# EAGLE design tarjeta (EAGLE 8.4.1)
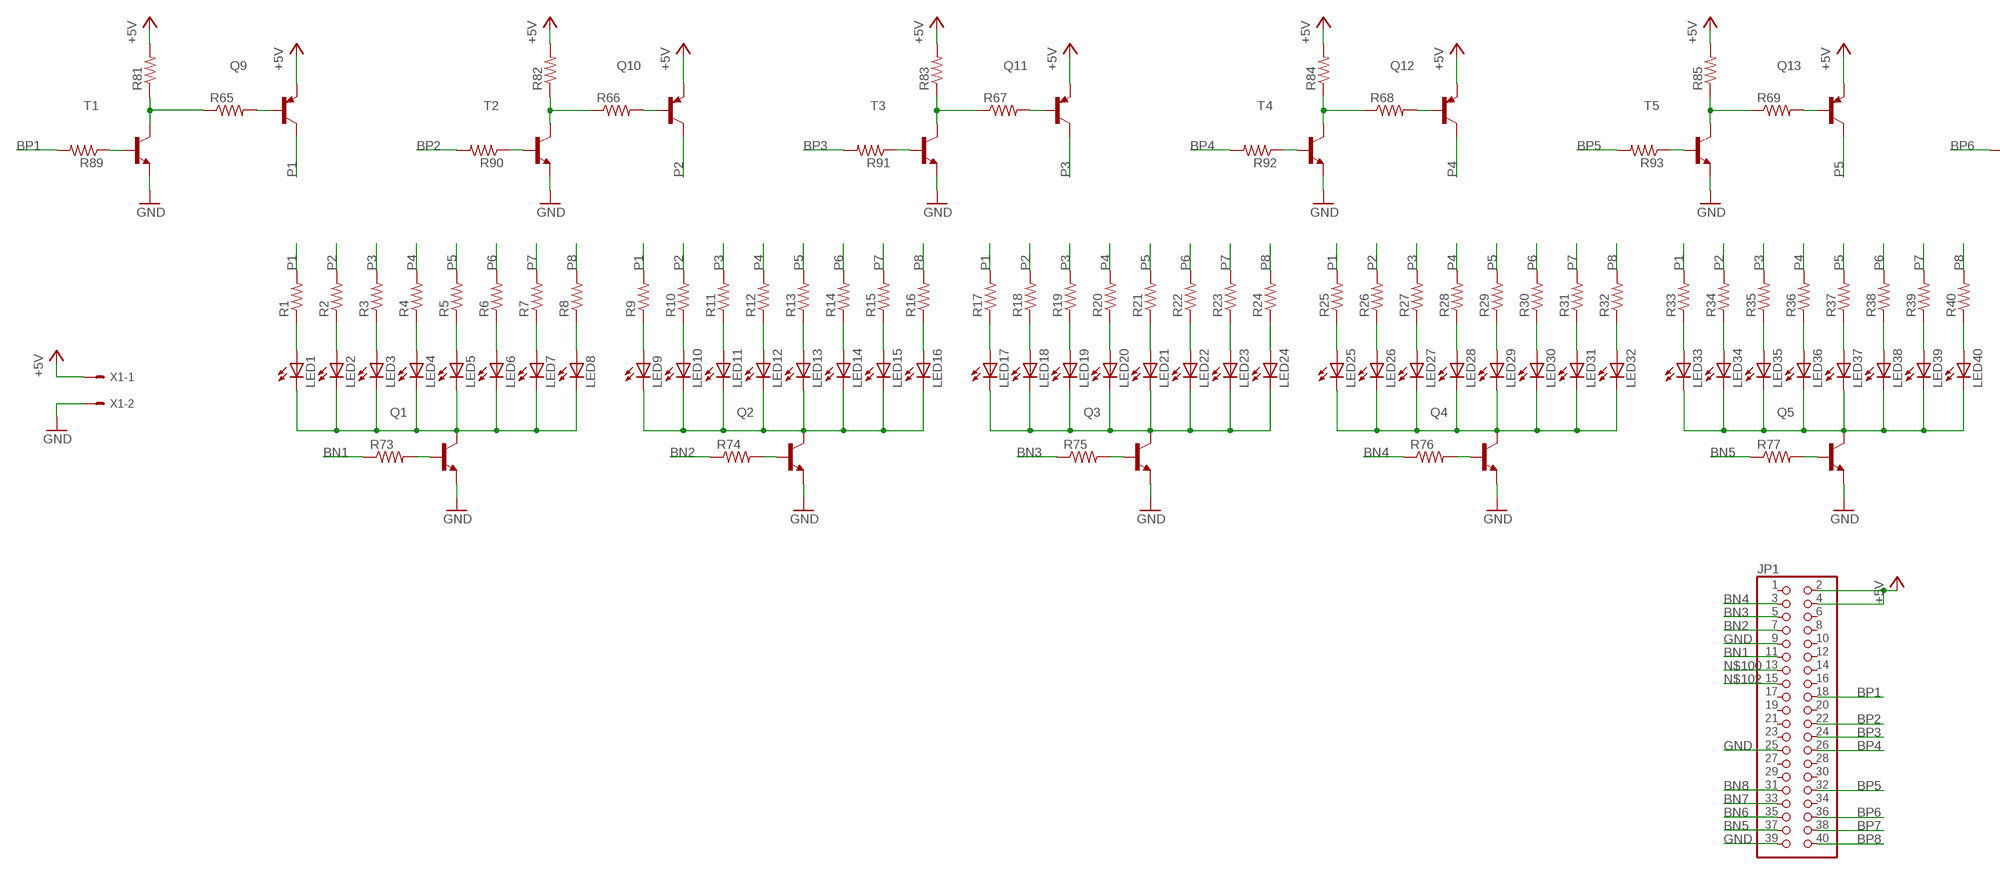
[diagram p0: schematic, sheet 1, part 1 of 2]
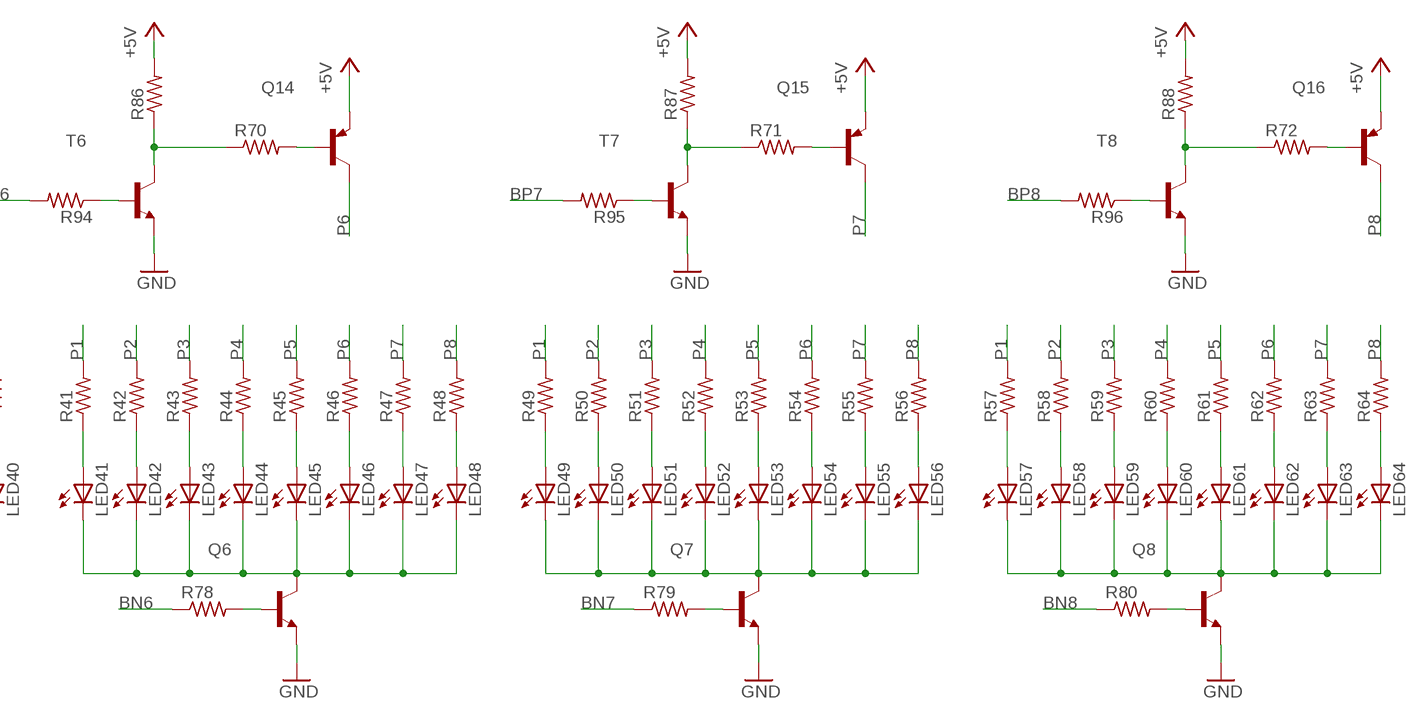
[diagram p1: schematic, sheet 1, part 2 of 2]

## Parts
JP1  PINHD-2X20  [2X20]
LED1  LED5MM  [LED5MM]
LED2  LED5MM  [LED5MM]
LED3  LED5MM  [LED5MM]
LED4  LED5MM  [LED5MM]
LED5  LED5MM  [LED5MM]
LED6  LED5MM  [LED5MM]
LED7  LED5MM  [LED5MM]
LED8  LED5MM  [LED5MM]
LED9  LED5MM  [LED5MM]
LED10  LED5MM  [LED5MM]
LED11  LED5MM  [LED5MM]
LED12  LED5MM  [LED5MM]
LED13  LED5MM  [LED5MM]
LED14  LED5MM  [LED5MM]
LED15  LED5MM  [LED5MM]
LED16  LED5MM  [LED5MM]
LED17  LED5MM  [LED5MM]
LED18  LED5MM  [LED5MM]
LED19  LED5MM  [LED5MM]
LED20  LED5MM  [LED5MM]
LED21  LED5MM  [LED5MM]
LED22  LED5MM  [LED5MM]
LED23  LED5MM  [LED5MM]
LED24  LED5MM  [LED5MM]
LED25  LED5MM  [LED5MM]
LED26  LED5MM  [LED5MM]
LED27  LED5MM  [LED5MM]
LED28  LED5MM  [LED5MM]
LED29  LED5MM  [LED5MM]
LED30  LED5MM  [LED5MM]
LED31  LED5MM  [LED5MM]
LED32  LED5MM  [LED5MM]
LED33  LED5MM  [LED5MM]
LED34  LED5MM  [LED5MM]
LED35  LED5MM  [LED5MM]
LED36  LED5MM  [LED5MM]
LED37  LED5MM  [LED5MM]
LED38  LED5MM  [LED5MM]
LED39  LED5MM  [LED5MM]
LED40  LED5MM  [LED5MM]
LED41  LED5MM  [LED5MM]
LED42  LED5MM  [LED5MM]
LED43  LED5MM  [LED5MM]
LED44  LED5MM  [LED5MM]
LED45  LED5MM  [LED5MM]
LED46  LED5MM  [LED5MM]
LED47  LED5MM  [LED5MM]
LED48  LED5MM  [LED5MM]
LED49  LED5MM  [LED5MM]
LED50  LED5MM  [LED5MM]
LED51  LED5MM  [LED5MM]
LED52  LED5MM  [LED5MM]
LED53  LED5MM  [LED5MM]
LED54  LED5MM  [LED5MM]
LED55  LED5MM  [LED5MM]
LED56  LED5MM  [LED5MM]
LED57  LED5MM  [LED5MM]
LED58  LED5MM  [LED5MM]
LED59  LED5MM  [LED5MM]
LED60  LED5MM  [LED5MM]
LED61  LED5MM  [LED5MM]
LED62  LED5MM  [LED5MM]
LED63  LED5MM  [LED5MM]
LED64  LED5MM  [LED5MM]
Q1  2N2222TO92-CBE  [TO92-CBE]
Q2  2N2222TO92-CBE  [TO92-CBE]
Q3  2N2222TO92-CBE  [TO92-CBE]
Q4  2N2222TO92-CBE  [TO92-CBE]
Q5  2N2222TO92-CBE  [TO92-CBE]
Q6  2N2222TO92-CBE  [TO92-CBE]
Q7  2N2222TO92-CBE  [TO92-CBE]
Q8  2N2222TO92-CBE  [TO92-CBE]
Q9  2N2907TO92-CBE  [TO92-CBE]
Q10  2N2907TO92-CBE  [TO92-CBE]
Q11  2N2907TO92-CBE  [TO92-CBE]
Q12  2N2907TO92-CBE  [TO92-CBE]
Q13  2N2907TO92-CBE  [TO92-CBE]
Q14  2N2907TO92-CBE  [TO92-CBE]
Q15  2N2907TO92-CBE  [TO92-CBE]
Q16  2N2907TO92-CBE  [TO92-CBE]
R1  R-US_0204/7  [0204/7]
R2  R-US_0204/7  [0204/7]
R3  R-US_0204/7  [0204/7]
R4  R-US_0204/7  [0204/7]
R5  R-US_0204/7  [0204/7]
R6  R-US_0204/7  [0204/7]
R7  R-US_0204/7  [0204/7]
R8  R-US_0204/7  [0204/7]
R9  R-US_0204/7  [0204/7]
R10  R-US_0204/7  [0204/7]
R11  R-US_0204/7  [0204/7]
R12  R-US_0204/7  [0204/7]
R13  R-US_0204/7  [0204/7]
R14  R-US_0204/7  [0204/7]
R15  R-US_0204/7  [0204/7]
R16  R-US_0204/7  [0204/7]
R17  R-US_0204/7  [0204/7]
R18  R-US_0204/7  [0204/7]
R19  R-US_0204/7  [0204/7]
R20  R-US_0204/7  [0204/7]
R21  R-US_0204/7  [0204/7]
R22  R-US_0204/7  [0204/7]
R23  R-US_0204/7  [0204/7]
R24  R-US_0204/7  [0204/7]
R25  R-US_0204/7  [0204/7]
R26  R-US_0204/7  [0204/7]
R27  R-US_0204/7  [0204/7]
R28  R-US_0204/7  [0204/7]
R29  R-US_0204/7  [0204/7]
R30  R-US_0204/7  [0204/7]
R31  R-US_0204/7  [0204/7]
R32  R-US_0204/7  [0204/7]
R33  R-US_0204/7  [0204/7]
R34  R-US_0204/7  [0204/7]
R35  R-US_0204/7  [0204/7]
R36  R-US_0204/7  [0204/7]
R37  R-US_0204/7  [0204/7]
R38  R-US_0204/7  [0204/7]
R39  R-US_0204/7  [0204/7]
R40  R-US_0204/7  [0204/7]
R41  R-US_0204/7  [0204/7]
R42  R-US_0204/7  [0204/7]
R43  R-US_0204/7  [0204/7]
R44  R-US_0204/7  [0204/7]
R45  R-US_0204/7  [0204/7]
R46  R-US_0204/7  [0204/7]
R47  R-US_0204/7  [0204/7]
R48  R-US_0204/7  [0204/7]
R49  R-US_0204/7  [0204/7]
R50  R-US_0204/7  [0204/7]
R51  R-US_0204/7  [0204/7]
R52  R-US_0204/7  [0204/7]
R53  R-US_0204/7  [0204/7]
R54  R-US_0204/7  [0204/7]
R55  R-US_0204/7  [0204/7]
R56  R-US_0204/7  [0204/7]
R57  R-US_0204/7  [0204/7]
R58  R-US_0204/7  [0204/7]
R59  R-US_0204/7  [0204/7]
R60  R-US_0204/7  [0204/7]
R61  R-US_0204/7  [0204/7]
R62  R-US_0204/7  [0204/7]
R63  R-US_0204/7  [0204/7]
R64  R-US_0204/7  [0204/7]
R65  R-US_0204/7  [0204/7]
R66  R-US_0204/7  [0204/7]
R67  R-US_0204/7  [0204/7]
R68  R-US_0204/7  [0204/7]
R69  R-US_0204/7  [0204/7]
R70  R-US_0204/7  [0204/7]
R71  R-US_0204/7  [0204/7]
R72  R-US_0204/7  [0204/7]
R73  R-US_0204/7  [0204/7]
R74  R-US_0204/7  [0204/7]
R75  R-US_0204/7  [0204/7]
R76  R-US_0204/7  [0204/7]
R77  R-US_0204/7  [0204/7]
R78  R-US_0204/7  [0204/7]
R79  R-US_0204/7  [0204/7]
R80  R-US_0204/7  [0204/7]
R81  R-US_0204/7  [0204/7]
R82  R-US_0204/7  [0204/7]
R83  R-US_0204/7  [0204/7]
R84  R-US_0204/7  [0204/7]
R85  R-US_0204/7  [0204/7]
R86  R-US_0204/7  [0204/7]
R87  R-US_0204/7  [0204/7]
R88  R-US_0204/7  [0204/7]
R89  R-US_0204/7  [0204/7]
R90  R-US_0204/7  [0204/7]
R91  R-US_0204/7  [0204/7]
R92  R-US_0204/7  [0204/7]
R93  R-US_0204/7  [0204/7]
R94  R-US_0204/7  [0204/7]
R95  R-US_0204/7  [0204/7]
R96  R-US_0204/7  [0204/7]
T1  2N3904TO92-CBE  [TO92-CBE]
T2  2N3904TO92-CBE  [TO92-CBE]
T3  2N3904TO92-CBE  [TO92-CBE]
T4  2N3904TO92-CBE  [TO92-CBE]
T5  2N3904TO92-CBE  [TO92-CBE]
T6  2N3904TO92-CBE  [TO92-CBE]
T7  2N3904TO92-CBE  [TO92-CBE]
T8  2N3904TO92-CBE  [TO92-CBE]
X1  KK-156-2  [KK-156-2]

## Nets
+5V: JP1.2 JP1.4 Q9.E Q10.E Q11.E Q12.E Q13.E Q14.E Q15.E Q16.E R81.2 R82.2 R83.2 R84.2 R85.2 R86.2 R87.2 R88.2 X1.1
BN1: JP1.11 R73.1
BN2: JP1.7 R74.1
BN3: JP1.5 R75.1
BN4: JP1.3 R76.1
BN5: JP1.37 R77.1
BN6: JP1.35 R78.1
BN7: JP1.33 R79.1
BN8: JP1.31 R80.1
BP1: JP1.18 R89.2
BP2: JP1.22 R90.2
BP3: JP1.24 R91.2
BP4: JP1.26 R92.2
BP5: JP1.32 R93.2
BP6: JP1.36 R94.2
BP7: JP1.38 R95.2
BP8: JP1.40 R96.2
GND: JP1.9 JP1.25 JP1.39 Q1.E Q2.E Q3.E Q4.E Q5.E Q6.E Q7.E Q8.E T1.E T2.E T3.E T4.E T5.E T6.E T7.E T8.E X1.2
N$1: LED1.K(C) LED2.K(C) LED3.K(C) LED4.K(C) LED5.K(C) LED6.K(C) LED7.K(C) LED8.K(C) Q1.C
N$2: LED1.A R1.1
N$3: LED2.A R2.1
N$4: LED3.A R3.1
N$5: LED4.A R4.1
N$6: LED5.A R5.1
N$7: LED6.A R6.1
N$8: LED7.A R7.1
N$9: LED8.A R8.1
N$10: LED9.K(C) LED10.K(C) LED11.K(C) LED12.K(C) LED13.K(C) LED14.K(C) LED15.K(C) LED16.K(C) Q2.C
N$11: LED9.A R9.1
N$12: LED10.A R10.1
N$13: LED11.A R11.1
N$14: LED12.A R12.1
N$15: LED13.A R13.1
N$16: LED14.A R14.1
N$17: LED15.A R15.1
N$18: LED16.A R16.1
N$19: LED17.K(C) LED18.K(C) LED19.K(C) LED20.K(C) LED21.K(C) LED22.K(C) LED23.K(C) LED24.K(C) Q3.C
N$20: LED17.A R17.1
N$21: LED18.A R18.1
N$22: LED19.A R19.1
N$23: LED20.A R20.1
N$24: LED21.A R21.1
N$25: LED22.A R22.1
N$26: LED23.A R23.1
N$27: LED24.A R24.1
N$28: LED25.K(C) LED26.K(C) LED27.K(C) LED28.K(C) LED29.K(C) LED30.K(C) LED31.K(C) LED32.K(C) Q4.C
N$29: LED25.A R25.1
N$30: LED26.A R26.1
N$31: LED27.A R27.1
N$32: LED28.A R28.1
N$33: LED29.A R29.1
N$34: LED30.A R30.1
N$35: LED31.A R31.1
N$36: LED32.A R32.1
N$37: LED33.K(C) LED34.K(C) LED35.K(C) LED36.K(C) LED37.K(C) LED38.K(C) LED39.K(C) LED40.K(C) Q5.C
N$38: LED33.A R33.1
N$39: LED34.A R34.1
N$40: LED35.A R35.1
N$41: LED36.A R36.1
N$42: LED37.A R37.1
N$43: LED38.A R38.1
N$44: LED39.A R39.1
N$45: LED40.A R40.1
N$46: LED41.K(C) LED42.K(C) LED43.K(C) LED44.K(C) LED45.K(C) LED46.K(C) LED47.K(C) LED48.K(C) Q6.C
N$47: LED41.A R41.1
N$48: LED42.A R42.1
N$49: LED43.A R43.1
N$50: LED44.A R44.1
N$51: LED45.A R45.1
N$52: LED46.A R46.1
N$53: LED47.A R47.1
N$54: LED48.A R48.1
N$55: LED49.K(C) LED50.K(C) LED51.K(C) LED52.K(C) LED53.K(C) LED54.K(C) LED55.K(C) LED56.K(C) Q7.C
N$56: LED49.A R49.1
N$57: LED50.A R50.1
N$58: LED51.A R51.1
N$59: LED52.A R52.1
N$60: LED53.A R53.1
N$61: LED54.A R54.1
N$62: LED55.A R55.1
N$63: LED56.A R56.1
N$64: LED57.K(C) LED58.K(C) LED59.K(C) LED60.K(C) LED61.K(C) LED62.K(C) LED63.K(C) LED64.K(C) Q8.C
N$65: LED57.A R57.1
N$66: LED58.A R58.1
N$67: LED59.A R59.1
N$68: LED60.A R60.1
N$69: LED61.A R61.1
N$70: LED62.A R62.1
N$71: LED63.A R63.1
N$72: LED64.A R64.1
N$73: Q9.B R65.2
N$74: R65.1 R81.1 T1.C
N$75: R66.1 R82.1 T2.C
N$76: Q10.B R66.2
N$77: R67.1 R83.1 T3.C
N$78: Q11.B R67.2
N$79: R68.1 R84.1 T4.C
N$80: Q12.B R68.2
N$81: R69.1 R85.1 T5.C
N$82: Q13.B R69.2
N$83: R70.1 R86.1 T6.C
N$84: Q14.B R70.2
N$85: R71.1 R87.1 T7.C
N$86: Q15.B R71.2
N$87: R72.1 R88.1 T8.C
N$88: Q16.B R72.2
N$89: Q8.B R80.2
N$90: Q7.B R79.2
N$91: Q6.B R78.2
N$92: Q5.B R77.2
N$93: Q4.B R76.2
N$94: Q3.B R75.2
N$95: Q2.B R74.2
N$96: Q1.B R73.2
N$97: R96.1 T8.B
N$99: R95.1 T7.B
N$100: JP1.13
N$101: R94.1 T6.B
N$102: JP1.15
N$103: R93.1 T5.B
N$105: R92.1 T4.B
N$107: R91.1 T3.B
N$109: R89.1 T1.B
N$110: R90.1 T2.B
P1: Q9.C R1.2 R9.2 R17.2 R25.2 R33.2 R41.2 R49.2 R57.2
P2: Q10.C R2.2 R10.2 R18.2 R26.2 R34.2 R42.2 R50.2 R58.2
P3: Q11.C R3.2 R11.2 R19.2 R27.2 R35.2 R43.2 R51.2 R59.2
P4: Q12.C R4.2 R12.2 R20.2 R28.2 R36.2 R44.2 R52.2 R60.2
P5: Q13.C R5.2 R13.2 R21.2 R29.2 R37.2 R45.2 R53.2 R61.2
P6: Q14.C R6.2 R14.2 R22.2 R30.2 R38.2 R46.2 R54.2 R62.2
P7: Q15.C R7.2 R15.2 R23.2 R31.2 R39.2 R47.2 R55.2 R63.2
P8: Q16.C R8.2 R16.2 R24.2 R32.2 R40.2 R48.2 R56.2 R64.2
Unconnected: JP1.1 JP1.6 JP1.8 JP1.10 JP1.12 JP1.14 JP1.16 JP1.17 JP1.19 JP1.20 JP1.21 JP1.23 JP1.27 JP1.28 JP1.29 JP1.30 JP1.34

## Library data of the parts
JP1 = pinhead:PINHD-2X20: PIN HEADER
LED1-LED32 LED34-LED64 = introduccion:LED: LED OSRAM: - CHIPLED LG R971, LG N971, LY N971, LG Q971, LY Q971, LO R971, LY R971 LH N974, LH R974 LS Q976, LO Q976, LY Q976 LO Q996 - Hyper CHIPLED LW Q18S LB Q993, LB Q99A, LB R99A - SideLED LS A670, LO A670, LY A670, LG A670, LP A670 LB A673, LV A673, LT A673, LW A673 LH A674 LY A675 LS A676, LA A676, LO A676, LY A676, LW A676 LS A679, LY A679, LG A679 - Hyper Micro SIDELED® LS Y876, LA Y876, LO Y876, LY Y876 LT Y87S - SmartLED LW L88C, LW L88S LB L89C, LB L89S, LG L890 LS L89K, LO L89K, LY L89K LS L896, LA L896, LO L896, LY L896 - TOPLED LS T670, LO T670, LY T670, LG T670, LP T670 LSG T670, LSP T670, LSY T670, LOP T670, LYG T670 LG T671, LOG T671, LSG T671 LB T673, LV T673, LT T673, LW T673 LH T674 LS T676, LA T676, LO T676, LY T676, LB T676, LH T676, LSB T676, LW T676 LB T67C, LV T67C, LT T67C, LS T67K, LO T67K, LY T67K, LW E67C LS E67B, LA E67B, LO E67B, LY E67B, LB E67C, LV E67C, LT E67C LW T67C LS T679, LY T679, LG T679 LS T770, LO T770, LY T770, LG T770, LP T770 LB T773, LV T773, LT T773, LW T773 LH T774 LS E675, LA E675, LY E675, LS T675 LS T776, LA T776, LO T776, LY T776, LB T776 LHGB T686 LT T68C, LB T68C - Hyper Mini TOPLED® LB M676 - Mini TOPLED Santana® LG M470 LS M47K, LO M47K, LY M47K Source: http://www.osram.convergy.de LUXEON: - LUMILED® LXK2-PW12-R00, LXK2-PW12-S00, LXK2-PW14-U00, LXK2-PW14-V00 LXK2-PM12-R00, LXK2-PM12-S00, LXK2-PM14-U00 LXK2-PE12-Q00, LXK2-PE12-R00, LXK2-PE12-S00, LXK2-PE14-T00, LXK2-PE14-U00 LXK2-PB12-K00, LXK2-PB12-L00, LXK2-PB12-M00, LXK2-PB14-N00, LXK2-PB14-P00, LXK2-PB14-Q00 LXK2-PR12-L00, LXK2-PR12-M00, LXK2-PR14-Q00, LXK2-PR14-R00 LXK2-PD12-Q00, LXK2-PD12-R00, LXK2-PD12-S00 LXK2-PH12-R00, LXK2-PH12-S00 LXK2-PL12-P00, LXK2-PL12-Q00, LXK2-PL12-R00 Source: www.luxeon.com KINGBRIGHT: KA-3528ASYC Source: www.kingbright.com
LED33 = led:LED: LED OSRAM: - CHIPLED LG R971, LG N971, LY N971, LG Q971, LY Q971, LO R971, LY R971 LH N974, LH R974 LS Q976, LO Q976, LY Q976 LO Q996 - Hyper CHIPLED LW Q18S LB Q993, LB Q99A, LB R99A - SideLED LS A670, LO A670, LY A670, LG A670, LP A670 LB A673, LV A673, LT A673, LW A673 LH A674 LY A675 LS A676, LA A676, LO A676, LY A676, LW A676 LS A679, LY A679, LG A679 - Hyper Micro SIDELED® LS Y876, LA Y876, LO Y876, LY Y876 LT Y87S - SmartLED LW L88C, LW L88S LB L89C, LB L89S, LG L890 LS L89K, LO L89K, LY L89K LS L896, LA L896, LO L896, LY L896 - TOPLED LS T670, LO T670, LY T670, LG T670, LP T670 LSG T670, LSP T670, LSY T670, LOP T670, LYG T670 LG T671, LOG T671, LSG T671 LB T673, LV T673, LT T673, LW T673 LH T674 LS T676, LA T676, LO T676, LY T676, LB T676, LH T676, LSB T676, LW T676 LB T67C, LV T67C, LT T67C, LS T67K, LO T67K, LY T67K, LW E67C LS E67B, LA E67B, LO E67B, LY E67B, LB E67C, LV E67C, LT E67C LW T67C LS T679, LY T679, LG T679 LS T770, LO T770, LY T770, LG T770, LP T770 LB T773, LV T773, LT T773, LW T773 LH T774 LS E675, LA E675, LY E675, LS T675 LS T776, LA T776, LO T776, LY T776, LB T776 LHGB T686 LT T68C, LB T68C - Hyper Mini TOPLED® LB M676 - Mini TOPLED Santana® LG M470 LS M47K, LO M47K, LY M47K Source: http://www.osram.convergy.de LUXEON: - LUMILED® LXK2-PW12-R00, LXK2-PW12-S00, LXK2-PW14-U00, LXK2-PW14-V00 LXK2-PM12-R00, LXK2-PM12-S00, LXK2-PM14-U00 LXK2-PE12-Q00, LXK2-PE12-R00, LXK2-PE12-S00, LXK2-PE14-T00, LXK2-PE14-U00 LXK2-PB12-K00, LXK2-PB12-L00, LXK2-PB12-M00, LXK2-PB14-N00, LXK2-PB14-P00, LXK2-PB14-Q00 LXK2-PR12-L00, LXK2-PR12-M00, LXK2-PR14-Q00, LXK2-PR14-R00 LXK2-PD12-Q00, LXK2-PD12-R00, LXK2-PD12-S00 LXK2-PH12-R00, LXK2-PH12-S00 LXK2-PL12-P00, LXK2-PL12-Q00, LXK2-PL12-R00 Source: www.luxeon.com KINGBRIGHT: KA-3528ASYC Source: www.kingbright.com
Q1-Q8 = introduccion:2N2222*: NPN Transistor
Q9-Q16 = introduccion:2N2907*: PNP Transistor
R1-R96 = rcl:R-US_: RESISTOR, American symbol
T1-T8 = introduccion:2N3904: NPN TRANSISTOR
X1 = con-molex:KK-156-2: KK 156 HEADER Source: http://www.molex.com/pdm_docs/sd/026604100_sd.pdf; OC_FARNELL: unknown; OC_NEWARK: unknown

## Board
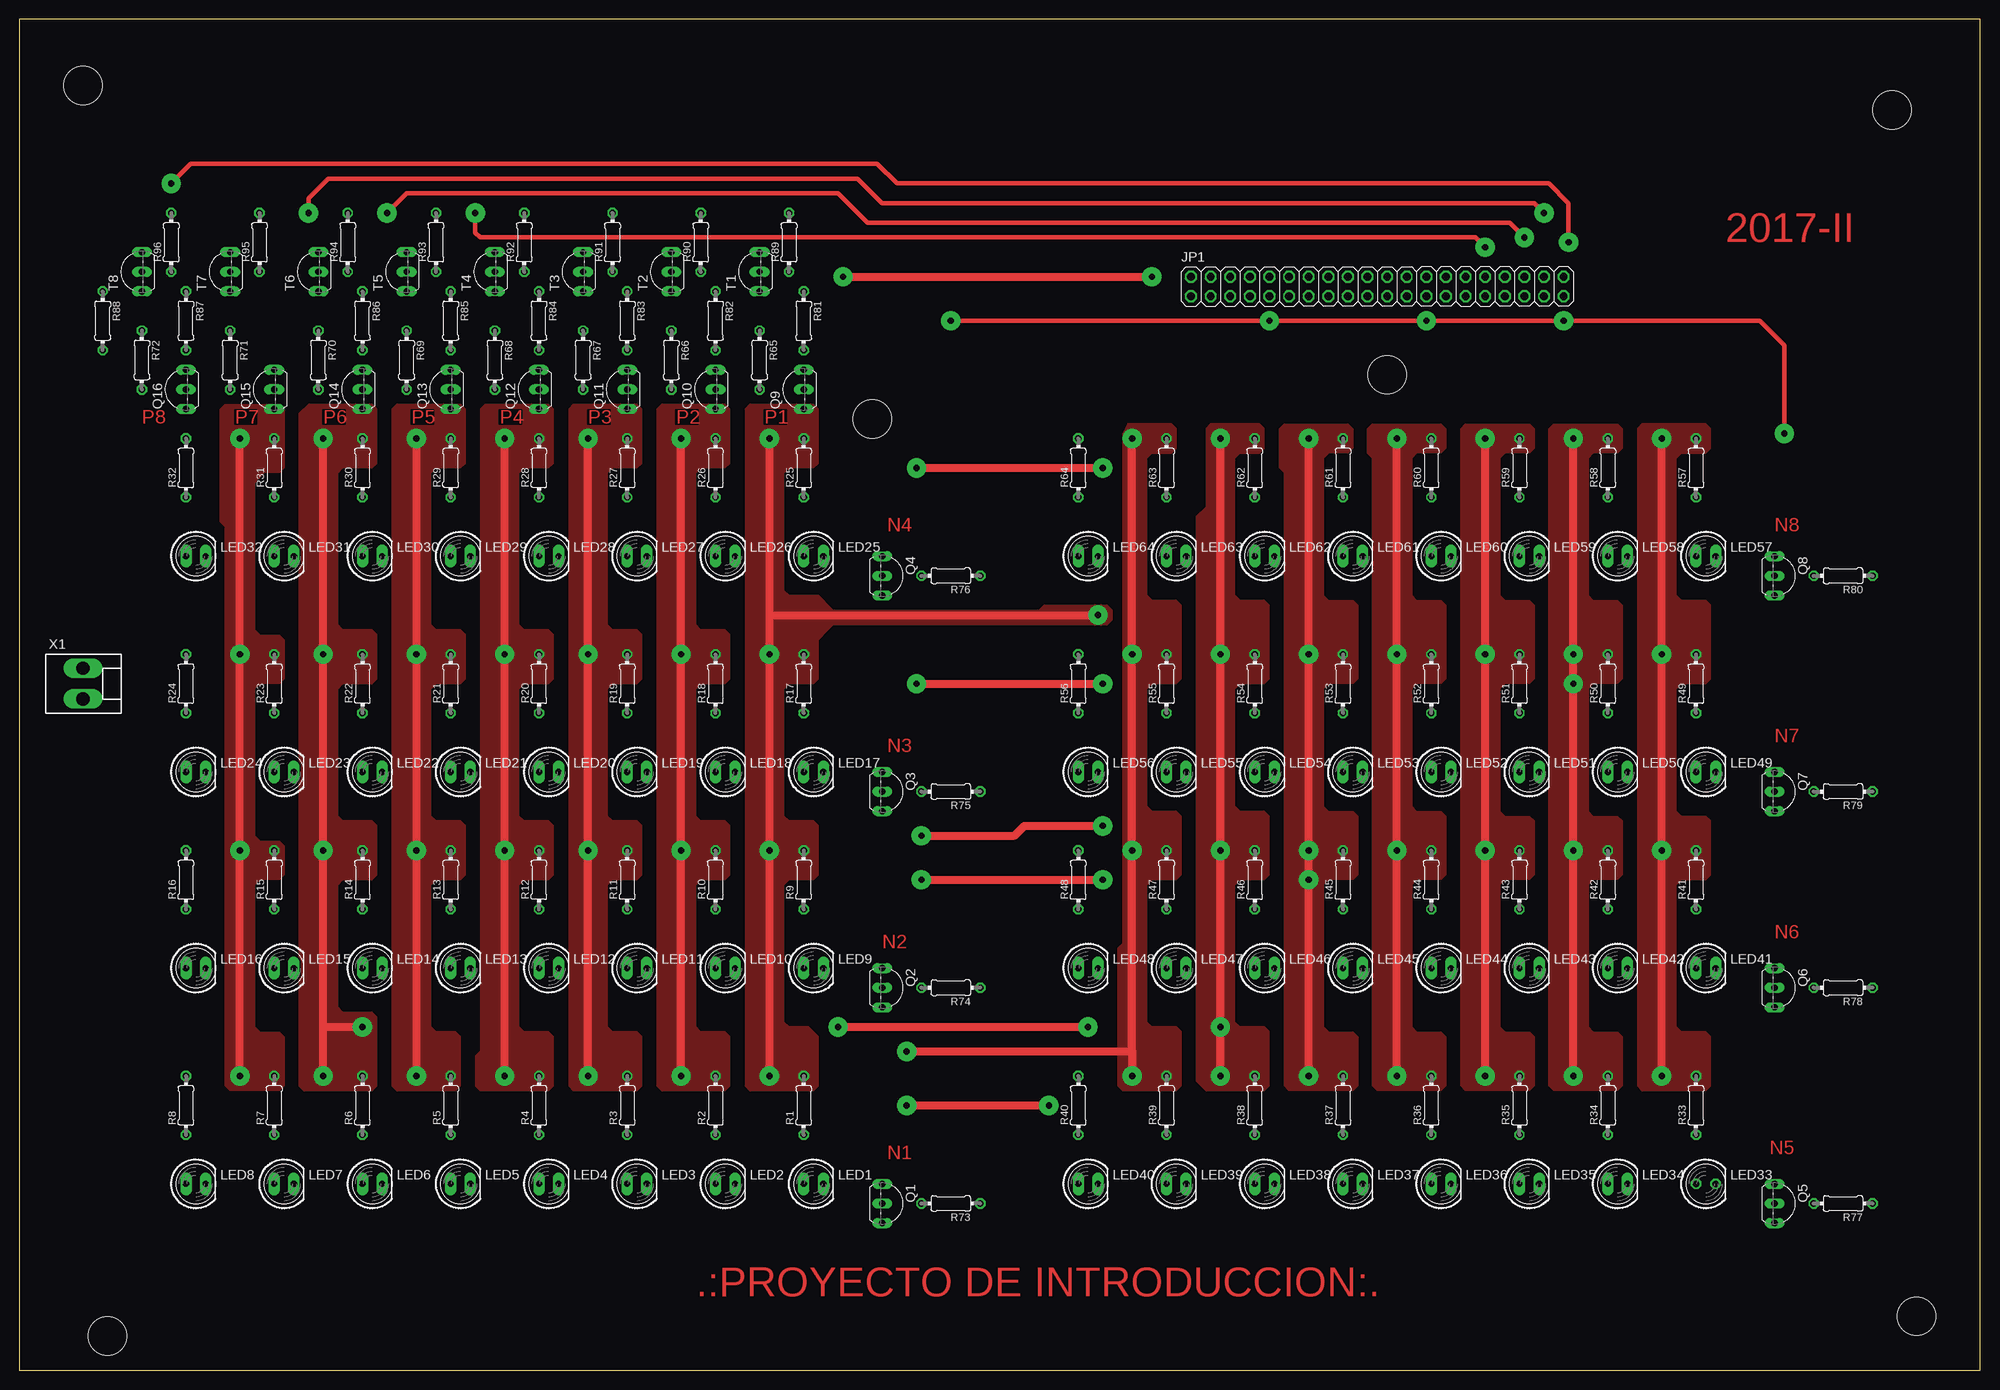
[diagram p2: board, top side]
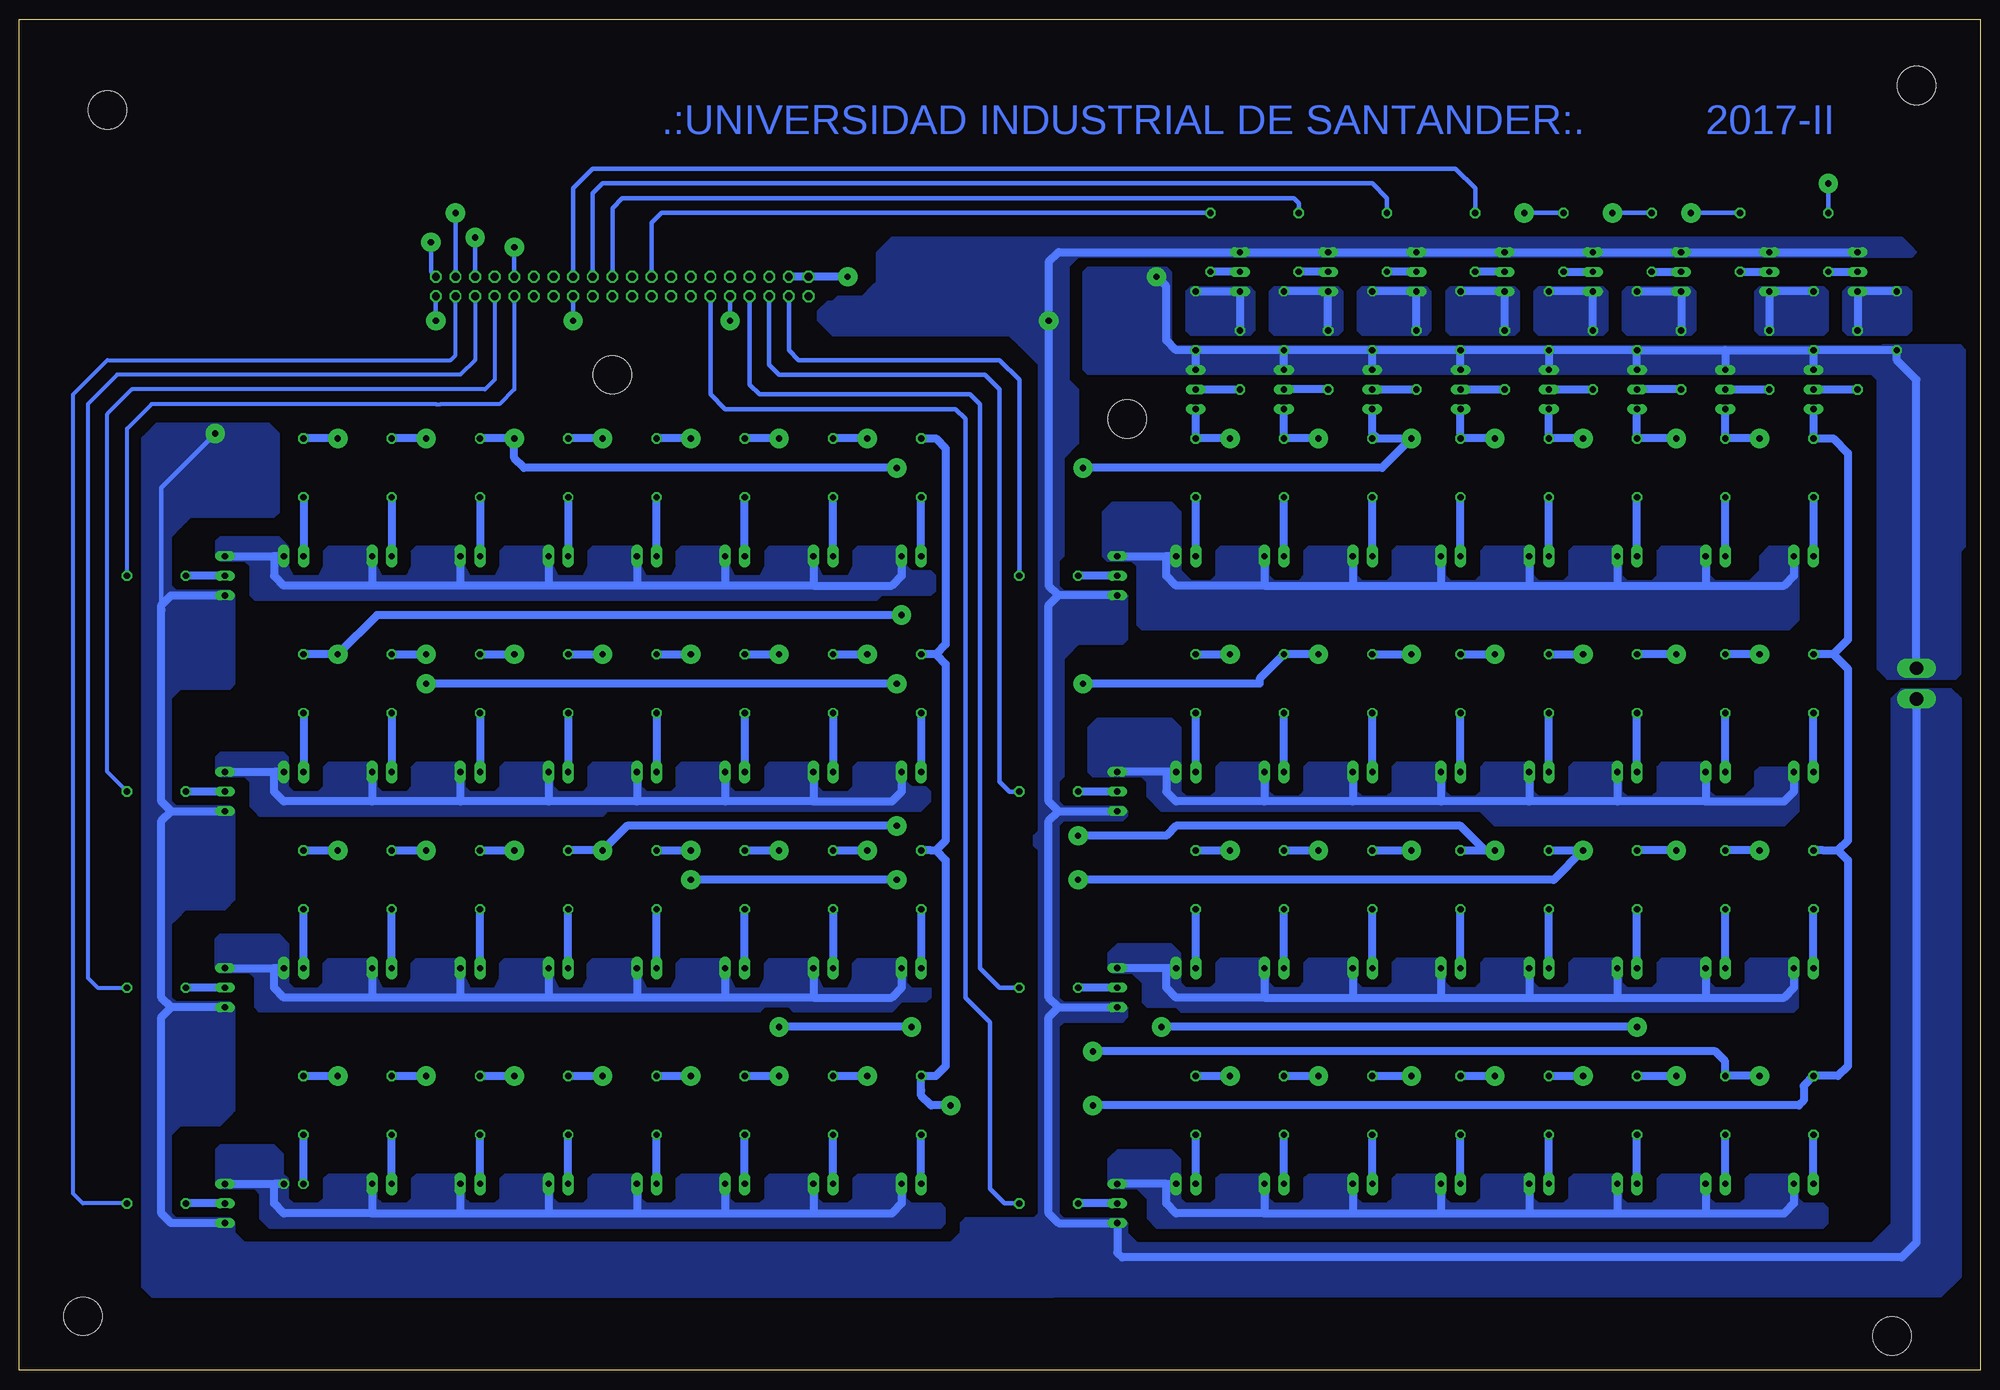
[diagram p3: board, bottom side, seen from below]

Size 253.98 x 174.93 mm. Coordinates in mm from the lower left corner, seen from the top.
Outline: 0,0 253.98,0 253.98,174.93 0,174.93 0,0
Copper layers (1*16): Top 0.035mm / dielectric 1.5mm / Bottom 0.035mm
Design rules "default": minimum track width 6mil, minimum drill 0.35mm, track to track 6mil, track to pad 6mil, pad to pad 6mil, via to via 6mil, smd to smd 6mil, copper to edge 40mil, drill to drill 6mil, minimum pad ring 10mil, minimum via ring 8mil, stop-mask expansion 4mil, vias tented up to drill 0mil, thermal gap 10mil
Holes 5 mm at 8.25,166.37 242.57,163.19 11.43,4.45 245.74,6.99 110.49,123.19 177.16,128.91

### Footprints (pad centres in the part's own frame; a part is rotated, then mirrored left to right if it is on the bottom)
2X20 = drill 1.016 octagon: 1 -24.13,-1.27; 2 -24.13,1.27; 3 -21.59,-1.27; 4 -21.59,1.27; 5 -19.05,-1.27; 6 -19.05,1.27; 7 -16.51,-1.27; 8 -16.51,1.27; 9 -13.97,-1.27; 10 -13.97,1.27; 11 -11.43,-1.27; 12 -11.43,1.27; 13 -8.89,-1.27; 14 -8.89,1.27; 15 -6.35,-1.27; 16 -6.35,1.27; 17 -3.81,-1.27; 18 -3.81,1.27; 19 -1.27,-1.27; 20 -1.27,1.27; 21 1.27,-1.27; 22 1.27,1.27; 23 3.81,-1.27; 24 3.81,1.27; 25 6.35,-1.27; 26 6.35,1.27; 27 8.89,-1.27; 28 8.89,1.27; 29 11.43,-1.27; 30 11.43,1.27; 31 13.97,-1.27; 32 13.97,1.27; 33 16.51,-1.27; 34 16.51,1.27; 35 19.05,-1.27; 36 19.05,1.27; 37 21.59,-1.27; 38 21.59,1.27; 39 24.13,-1.27; 40 24.13,1.27
LED5MM = drill 0.8 pad 1.5 long: A -1.27,0; K 1.27,0
LED5MM' = drill 0.813 octagon: A -1.27,0; K 1.27,0
TO92-CBE = drill 0.813 long: B 0,0; C -2.54,0; E 2.54,0
0204/7 = drill 0.813 octagon: 1 -3.81,0; 2 3.81,0
KK-156-2 = drill 1.7 pad 2.184 long: 1 -1.98,0; 2 1.98,0

### Placement (x,y rotation side)
JP1  175.9,140.34 0 top
LED1  102.87,24.13 0 top
LED2  91.44,24.13 0 top
LED3  80.01,24.13 0 top
LED4  68.58,24.13 0 top
LED5  57.15,24.13 0 top
LED6  45.72,24.13 0 top
LED7  34.29,24.13 0 top
LED8  22.86,24.13 0 top
LED9  102.87,52.07 0 top
LED10  91.44,52.07 0 top
LED11  80.01,52.07 0 top
LED12  68.58,52.07 0 top
LED13  57.15,52.07 0 top
LED14  45.72,52.07 0 top
LED15  34.29,52.07 0 top
LED16  22.86,52.07 0 top
LED17  102.87,77.47 0 top
LED18  91.44,77.47 0 top
LED19  80.01,77.47 0 top
LED20  68.58,77.47 0 top
LED21  57.15,77.47 0 top
LED22  45.72,77.47 0 top
LED23  34.29,77.47 0 top
LED24  22.86,77.47 0 top
LED25  102.87,105.41 0 top
LED26  91.44,105.41 0 top
LED27  80.01,105.41 0 top
LED28  68.58,105.41 0 top
LED29  57.15,105.41 0 top
LED30  45.72,105.41 0 top
LED31  34.29,105.41 0 top
LED32  22.86,105.41 0 top
LED33  [LED5MM']  218.44,24.13 0 top
LED34  207.01,24.13 0 top
LED35  195.58,24.13 0 top
LED36  184.15,24.13 0 top
LED37  172.72,24.13 0 top
LED38  161.29,24.13 0 top
LED39  149.86,24.13 0 top
LED40  138.43,24.13 0 top
LED41  218.44,52.07 0 top
LED42  207.01,52.07 0 top
LED43  195.58,52.07 0 top
LED44  184.15,52.07 0 top
LED45  172.72,52.07 0 top
LED46  161.29,52.07 0 top
LED47  149.86,52.07 0 top
LED48  138.43,52.07 0 top
LED49  218.44,77.47 0 top
LED50  207.01,77.47 0 top
LED51  195.58,77.47 0 top
LED52  184.15,77.47 0 top
LED53  172.72,77.47 0 top
LED54  161.29,77.47 0 top
LED55  149.86,77.47 0 top
LED56  138.43,77.47 0 top
LED57  218.44,105.41 0 top
LED58  207.01,105.41 0 top
LED59  195.58,105.41 0 top
LED60  184.15,105.41 0 top
LED61  172.72,105.41 0 top
LED62  161.29,105.41 0 top
LED63  149.86,105.41 0 top
LED64  138.43,105.41 0 top
Q1  111.76,21.59 270 top
Q2  111.76,49.53 270 top
Q3  111.76,74.93 270 top
Q4  111.76,102.87 270 top
Q5  227.33,21.59 270 top
Q6  227.33,49.53 270 top
Q7  227.33,74.93 270 top
Q8  227.33,102.87 270 top
Q9  101.6,127 90 top
Q10  90.17,127 90 top
Q11  78.74,127 90 top
Q12  67.31,127 90 top
Q13  55.88,127 90 top
Q14  44.45,127 90 top
Q15  33.02,127 90 top
Q16  21.59,127 90 top
R1  101.6,34.29 90 top
R2  90.17,34.29 90 top
R3  78.74,34.29 90 top
R4  67.31,34.29 90 top
R5  55.88,34.29 90 top
R6  44.45,34.29 90 top
R7  33.02,34.29 90 top
R8  21.59,34.29 90 top
R9  101.6,63.5 90 top
R10  90.17,63.5 90 top
R11  78.74,63.5 90 top
R12  67.31,63.5 90 top
R13  55.88,63.5 90 top
R14  44.45,63.5 90 top
R15  33.02,63.5 90 top
R16  21.59,63.5 90 top
R17  101.6,88.9 90 top
R18  90.17,88.9 90 top
R19  78.74,88.9 90 top
R20  67.31,88.9 90 top
R21  55.88,88.9 90 top
R22  44.45,88.9 90 top
R23  33.02,88.9 90 top
R24  21.59,88.9 90 top
R25  101.6,116.84 90 top
R26  90.17,116.84 90 top
R27  78.74,116.84 90 top
R28  67.31,116.84 90 top
R29  55.88,116.84 90 top
R30  44.45,116.84 90 top
R31  33.02,116.84 90 top
R32  21.59,116.84 90 top
R33  217.17,34.29 90 top
R34  205.74,34.29 90 top
R35  194.31,34.29 90 top
R36  182.88,34.29 90 top
R37  171.45,34.29 90 top
R38  160.02,34.29 90 top
R39  148.59,34.29 90 top
R40  137.16,34.29 90 top
R41  217.17,63.5 90 top
R42  205.74,63.5 90 top
R43  194.31,63.5 90 top
R44  182.88,63.5 90 top
R45  171.45,63.5 90 top
R46  160.02,63.5 90 top
R47  148.59,63.5 90 top
R48  137.16,63.5 90 top
R49  217.17,88.9 90 top
R50  205.74,88.9 90 top
R51  194.31,88.9 90 top
R52  182.88,88.9 90 top
R53  171.45,88.9 90 top
R54  160.02,88.9 90 top
R55  148.59,88.9 90 top
R56  137.16,88.9 90 top
R57  217.17,116.84 90 top
R58  205.74,116.84 90 top
R59  194.31,116.84 90 top
R60  182.88,116.84 90 top
R61  171.45,116.84 90 top
R62  160.02,116.84 90 top
R63  148.59,116.84 90 top
R64  137.16,116.84 90 top
R65  95.88,130.81 270 top
R66  84.45,130.81 270 top
R67  73.02,130.81 270 top
R68  61.59,130.81 270 top
R69  50.16,130.81 270 top
R70  38.73,130.81 270 top
R71  27.31,130.81 270 top
R72  15.88,130.81 270 top
R73  120.65,21.59 180 top
R74  120.65,49.53 180 top
R75  120.65,74.93 180 top
R76  120.65,102.87 180 top
R77  236.22,21.59 180 top
R78  236.22,49.53 180 top
R79  236.22,74.93 180 top
R80  236.22,102.87 180 top
R81  101.6,135.89 270 top
R82  90.17,135.89 270 top
R83  78.74,135.89 270 top
R84  67.31,135.89 270 top
R85  55.88,135.89 270 top
R86  44.45,135.89 270 top
R87  21.59,135.89 270 top
R88  10.79,135.89 270 top
R89  99.69,146.05 90 top
R90  88.27,146.05 90 top
R91  76.83,146.05 90 top
R92  65.41,146.05 90 top
R93  53.97,146.05 90 top
R94  42.55,146.05 90 top
R95  31.11,146.05 90 top
R96  19.68,146.05 90 top
T1  95.88,142.24 90 top
T2  84.45,142.24 90 top
T3  73.02,142.24 90 top
T4  61.59,142.24 90 top
T5  50.16,142.24 90 top
T6  38.73,142.24 90 top
T7  27.31,142.24 90 top
T8  15.88,142.24 90 top
X1  8.25,88.9 270 top

### Tracks (layer width: path | path; a pad name or v marks a point on that pad's centre or on a via)
+5V  (via drill 0.8 pad 2.5)
  Top 1.016: v106.68,141.6 v146.69,141.6
  Bottom 1.016: Q9.E R81.2 | R82.2 R81.2 | Q10.E R82.2 | Q11.E R83.2 | Q12.E R84.2 | R85.2 Q13.E | R85.2 R84.2 | R84.2 R83.2 | R83.2 R82.2 | Q14.E R86.2 | R86.2 R85.2 | R86.2 33.02,132.08 | 33.02,132.08 Q15.E | 33.02,132.08 R87.2 | R87.2 Q16.E | R87.2 R88.2 10.79,130.81 8.25,128.27 X1.1 | R81.2 104.14,132.08 105.41,133.35 105.41,140.34 v106.68,141.6 | v146.69,141.6 JP1.2 JP1.4
  pour Bottom (no thermals): 10.16,132.72 9.52,132.72 8.89,132.08 8.89,130.18 8.89,129.54 9.52,128.91 34.92,128.91 105.41,128.91 115.57,128.91 116.2,129.54 116.2,142.24 115.57,142.88 105.41,142.88 104.77,142.24 104.77,133.35 104.14,132.72 11.43,132.72
  pour Bottom (no thermals): 6.35,89.53 3.81,89.53 3.18,89.53 2.54,90.17 2.54,106.05 1.91,106.68 1.91,128.27 1.91,132.08 2.54,132.72 12.7,132.72 13.97,131.44 13.97,128.91 13.33,128.27 13.33,90.81 12.07,89.53 7.62,89.53
BN1
  Bottom 0.61: R73.1 126.37,21.59 128.27,23.5 128.27,45.09 131.44,48.26 131.44,123.19 132.72,124.46 162.56,124.46 164.47,126.36 JP1.11
BN2
  Bottom 0.61: R74.1 127,49.53 129.54,52.07 129.54,125.09 130.81,126.36 158.12,126.36 159.38,127.64 JP1.7
BN3
  Bottom 0.61: R75.1 125.73,74.93 127,76.2 127,127 128.91,128.91 155.57,128.91 156.84,130.18 JP1.5
BN4
  Bottom 0.61: JP1.3 154.31,132.08 153.03,130.81 127,130.81 124.46,128.27 R76.1
BN5
  Bottom 0.508: R77.1 245.74,21.59 247.02,22.86 247.02,126.36 242.57,130.81 198.12,130.81 197.48,131.44 JP1.37
BN6
  Bottom 0.508: JP1.35 194.94,130.81 196.85,128.91 241.3,128.91 245.11,125.09 245.11,50.8 243.84,49.53 R78.1
BN7
  Bottom 0.508: R79.1 242.57,77.47 242.57,123.83 239.4,127 193.67,127 192.41,128.27 JP1.33
BN8
  Bottom 0.508: R80.1 240.03,121.92 236.85,125.09 200.03,125.09 199.39,125.09 191.77,125.09 189.87,127 JP1.31
BP1
  Bottom 0.61: R89.2 170.81,149.86 172.09,148.59 JP1.18
BP2
  Bottom 0.61: R90.2 88.27,151.13 88.9,151.76 175.9,151.76 177.16,150.5 JP1.22
BP3
  Bottom 0.61: R91.2 76.83,151.76 78.74,153.67 178.44,153.67 179.7,152.4 JP1.24
BP4
  Bottom 0.61: R92.2 65.41,153.03 67.94,155.57 179.7,155.57 182.25,153.03 JP1.26
BP5  (via drill 0.8 pad 2.5)
  Top 0.61: v189.87,145.41 188.59,146.69 59.69,146.69 59.05,147.32 v59.05,149.86
  Bottom 0.61: v189.87,145.41 JP1.32 | R93.2 v59.05,149.86
BP6  (via drill 0.8 pad 2.5)
  Top 0.61: v47.62,149.86 50.16,152.4 106.05,152.4 109.85,148.59 193.04,148.59 v194.94,146.69
  Bottom 0.61: JP1.36 v194.94,146.69 | R94.2 v47.62,149.86
BP7  (via drill 0.8 pad 2.5)
  Top 0.61: v37.47,149.86 37.47,151.76 40,154.31 108.59,154.31 111.76,151.13 196.22,151.13 v197.48,149.86
  Bottom 0.61: JP1.38 v197.48,149.86 | R95.2 v37.47,149.86
BP8  (via drill 0.8 pad 2.5)
  Top 0.61: v200.66,146.05 200.66,151.13 198.12,153.67 113.66,153.67 111.12,156.21 22.22,156.21 v19.68,153.67
  Bottom 0.61: v200.66,146.05 200.66,142.24 JP1.40 | R96.2 v19.68,153.67
GND  (via drill 0.8 pad 2.5)
  Top 0.61: v228.6,121.28 228.6,132.72 225.42,135.89 v200.03,135.89 v182.25,135.89 v161.92,135.89 v120.65,135.89
  Bottom 0.61: JP1.39 v200.03,135.89 | v182.25,135.89 JP1.25 | v161.92,135.89 JP1.9 | 235.59,98.42 235.59,114.3 v228.6,121.28
  Bottom 1.016: 119.38,46.99 120.65,45.72 120.65,20.32 119.38,19.05 Q1.E 111.76,15.24 111.12,14.61 10.16,14.61 8.25,16.51 X1.2 | 119.38,46.99 Q2.E | 119.38,46.99 120.65,48.26 120.65,71.12 119.38,72.39 | 119.38,72.39 Q3.E | 119.38,72.39 120.65,73.66 120.65,99.06 119.38,100.33 | T8.E T7.E T6.E T5.E T4.E T3.E T2.E T1.E 119.38,144.78 120.65,143.51 v120.65,135.89 120.65,101.6 119.38,100.33 | Q4.E 119.38,100.33 | Q5.E 234.31,19.05 235.59,20.32 235.59,45.72 234.31,46.99 | Q6.E 234.31,46.99 | 234.31,46.99 235.59,48.26 235.59,71.12 234.31,72.39 | 234.31,72.39 Q7.E | 234.31,72.39 235.59,73.66 235.59,98.42 235.59,99.06 234.31,100.33 Q8.E
  pour Bottom (no thermals): 6.98,88.27 3.81,88.27 2.54,87 2.54,61.59 2.54,40.01 2.54,17.14 2.54,12.06 5.08,9.53 115.57,9.53 120.65,9.53 121.92,10.79 121.92,27.3 121.92,67.31 122.56,67.94 122.56,69.22 121.92,69.85 121.92,104.78 121.92,130.18 124.46,132.72 125.73,133.99 148.59,133.99 150.5,135.89 150.5,137.16 149.22,138.43 148.59,138.43 147.95,139.06 144.78,139.06 143.51,140.34 142.88,140.97 142.88,144.78 141.6,146.05 140.97,146.69 10.16,146.69 8.89,145.41 8.25,144.78 8.89,144.15 28.57,144.15 116.84,144.15 118.11,142.88 118.11,142.24 118.11,128.27 116.84,127 116.84,120.02 118.75,118.11 118.75,105.41 119.38,104.78 119.38,104.14 119.38,101.6 118.75,100.97 111.12,100.97 110.49,100.33 110.49,94.61 111.12,93.98 114.94,93.98 116.84,93.98 118.11,92.71 118.75,92.08 118.75,86.36 118.75,76.83 119.38,76.2 119.38,74.93 119.38,73.66 118.75,73.03 111.12,73.03 110.49,72.39 110.49,71.75 111.12,71.12 118.75,71.12 119.38,70.48 119.38,62.87 119.38,48.26 118.75,47.62 111.12,47.62 110.49,46.99 110.49,45.72 111.12,45.09 118.75,45.09 119.38,44.45 119.38,28.57 119.38,20.32 118.75,19.68 111.12,19.68 110.49,19.05 110.49,17.78 109.22,16.51 13.97,16.51 11.43,19.05 11.43,64.77 11.43,87 10.16,88.27
  pour Bottom (no thermals): 121.92,20.32 122.56,19.68 131.44,19.68 132.08,19.05 132.08,18.41 132.08,17.78 133.35,16.51 151.13,16.51 186.69,16.51 224.79,16.51 226.06,17.78 226.06,19.05 226.69,19.68 233.68,19.68 234.31,20.32 234.31,24.77 234.31,30.48 233.04,31.75 227.97,31.75 226.69,33.02 226.06,33.66 226.06,45.09 226.06,46.99 226.69,47.62 233.68,47.62 234.31,48.26 234.31,57.78 233.68,58.42 232.41,59.69 229.23,59.69 228.6,59.69 227.33,59.69 226.06,60.96 226.06,71.75 226.06,72.39 226.69,73.03 233.04,73.03 233.68,73.03 234.31,73.66 234.31,87 233.04,88.27 229.87,88.27 226.69,88.27 226.06,88.9 226.06,100.33 226.69,100.97 233.68,100.97 234.31,101.6 234.31,103.5 234.31,107.95 233.04,109.22 232.41,109.86 231.78,110.49 220.98,110.49 220.34,111.12 220.34,121.28 221.62,122.56 234.31,122.56 236.22,122.56 237.49,121.28 238.12,120.65 238.12,104.14 238.12,95.25 238.12,76.83 238.12,62.87 238.12,38.73 238.12,10.79 236.85,9.53 213.36,9.53 120.01,9.53 120.01,20.32
N$1
  Bottom 1.016: LED8.K 24.13,21.59 25.4,20.32 35.56,20.32 | 105.41,24.13 105.41,21.59 104.14,20.32 92.71,20.32 | 105.41,24.13 LED1.K | 46.99,20.32 35.56,20.32 | 58.42,20.32 46.99,20.32 | 69.85,20.32 58.42,20.32 | 81.28,20.32 69.85,20.32 | 92.71,20.32 81.28,20.32 | 105.41,24.13 Q1.C | LED7.K 35.56,20.32 | LED6.K 46.99,20.32 | LED5.K 58.42,20.32 | LED4.K 69.85,20.32 | LED3.K 81.28,20.32 | LED2.K 92.71,20.32
  pour Bottom (no thermals): 20.32,21.59 22.86,21.59 23.5,22.23 23.5,24.77 24.13,25.4 29.85,25.4 30.48,24.77 30.48,22.23 31.11,21.59 34.29,21.59 34.92,22.23 34.92,24.77 35.56,25.4 41.28,25.4 41.91,24.77 41.91,22.23 42.55,21.59 45.72,21.59 46.35,22.23 46.35,24.77 46.99,25.4 52.7,25.4 53.34,24.77 53.34,22.23 53.97,21.59 57.15,21.59 57.78,22.23 57.78,24.77 58.42,25.4 64.13,25.4 64.77,24.77 64.77,22.23 65.41,21.59 68.58,21.59 69.22,22.23 69.22,24.77 69.85,25.4 75.56,25.4 76.2,24.77 76.2,22.23 76.83,21.59 80.01,21.59 80.64,22.23 80.64,24.77 81.28,25.4 86.99,25.4 87.63,24.77 87.63,22.23 88.27,21.59 91.44,21.59 92.08,22.23 92.08,24.77 92.71,25.4 98.42,25.4 99.06,24.77 99.06,22.23 99.69,21.59 102.87,21.59 103.5,22.23 103.5,27.3 104.77,28.57 111.76,28.57 113.03,27.3 113.03,24.13 112.4,23.5 109.22,23.5 107.95,22.23 107.95,19.68 106.68,18.41 20.32,18.41 19.68,19.05 19.68,20.95
N$2
  Bottom 1.016: LED1.A R1.1
N$3
  Bottom 1.016: LED2.A R2.1
N$4
  Bottom 1.016: LED3.A R3.1
N$5
  Bottom 1.016: LED4.A R4.1
N$6
  Bottom 1.016: LED5.A R5.1
N$7
  Bottom 1.016: LED6.A R6.1
N$8
  Bottom 1.016: LED7.A R7.1
N$9
  Bottom 1.016: LED8.A R8.1
N$10
  Bottom 1.016: LED16.K 24.13,49.53 25.4,48.26 35.56,48.26 | 46.99,48.26 35.56,48.26 | 58.42,48.26 46.99,48.26 | 69.85,48.26 58.42,48.26 | 81.28,48.26 69.85,48.26 | 92.71,48.26 81.28,48.26 | 92.71,48.26 104.14,48.26 105.41,49.53 105.41,52.07 LED9.K Q2.C | LED15.K 35.56,48.26 | LED14.K 46.99,48.26 | LED13.K 58.42,48.26 | LED12.K 69.85,48.26 | LED11.K 81.28,48.26 | LED10.K 92.71,48.26
  pour Bottom (no thermals): 23.5,46.99 23.5,52.7 24.13,53.34 29.85,53.34 30.48,52.7 30.48,50.16 31.11,49.53 34.29,49.53 34.92,50.16 34.92,52.7 35.56,53.34 41.28,53.34 41.91,52.7 41.91,50.16 42.55,49.53 45.72,49.53 46.35,50.16 46.35,52.7 46.99,53.34 52.7,53.34 53.34,52.7 53.34,50.16 53.97,49.53 57.15,49.53 57.78,50.16 57.78,52.7 58.42,53.34 64.13,53.34 64.77,52.7 64.77,50.16 65.41,49.53 68.58,49.53 69.22,50.16 69.22,52.7 69.85,53.34 75.56,53.34 76.2,52.7 76.2,50.16 76.83,49.53 80.01,49.53 80.64,50.16 80.64,52.7 81.28,53.34 86.99,53.34 87.63,52.7 87.63,50.16 88.27,49.53 91.44,49.53 92.08,50.16 92.08,52.7 92.71,53.34 98.42,53.34 99.06,52.7 99.06,50.16 99.69,49.53 102.87,49.53 103.5,50.16 103.5,53.98 104.77,55.24 111.76,55.24 113.03,53.98 113.03,52.07 112.4,51.44 109.85,51.44 108.59,50.16 108.59,47.62 107.95,46.99 104.14,46.99 103.5,46.35 24.13,46.35
N$11
  Bottom 1.016: LED9.A R9.1
N$12
  Bottom 1.016: LED10.A R10.1
N$13
  Bottom 1.016: LED11.A R11.1
N$14
  Bottom 1.016: LED12.A R12.1
N$15
  Bottom 1.016: LED13.A R13.1
N$16
  Bottom 1.016: LED14.A R14.1
N$17
  Bottom 1.016: LED15.A R15.1
N$18
  Bottom 1.016: LED16.A R16.1
N$19
  Bottom 1.016: LED24.K 24.13,74.93 25.4,73.66 35.56,73.66 | 81.28,73.66 92.71,73.66 | 69.85,73.66 81.28,73.66 | 58.42,73.66 69.85,73.66 | 46.99,73.66 58.42,73.66 | 35.56,73.66 46.99,73.66 | 92.71,73.66 104.14,73.66 105.41,74.93 105.41,77.47 LED17.K Q3.C | LED18.K 92.71,73.66 | LED19.K 81.28,73.66 | LED20.K 69.85,73.66 | LED21.K 58.42,73.66 | LED22.K 46.99,73.66 | LED23.K 35.56,73.66
  pour Bottom (no thermals): 23.5,77.47 23.5,72.39 25.4,70.48 62.86,70.48 64.77,72.39 106.05,72.39 107.95,74.3 107.95,76.2 108.59,76.83 114.94,76.83 115.57,77.47 115.57,83.19 114.3,84.45 104.77,84.45 103.5,83.19 103.5,74.93 102.87,74.3 30.48,74.3 29.21,75.56 29.21,77.47 28.57,78.11 24.13,78.11
  pour Bottom (no thermals): 34.29,74.3 34.92,74.93 34.92,78.11 35.56,78.74 41.28,78.74 41.91,78.11 41.91,74.93 42.55,74.3 45.72,74.3 46.35,74.93 46.35,78.11 46.99,78.74 52.7,78.74 53.34,78.11 53.34,74.93 53.97,74.3 57.15,74.3 57.78,74.93 57.78,78.11 58.42,78.74 64.13,78.74 64.77,78.11 64.77,74.93 65.41,74.3 68.58,74.3 69.22,74.93 69.22,78.11 69.85,78.74 75.56,78.74 76.2,78.11 76.2,74.93 76.83,74.3 80.01,74.3 80.64,74.93 80.64,78.11 81.28,78.74 86.99,78.74 87.63,78.11 87.63,74.93 88.27,74.3 91.44,74.3 92.08,74.93 92.08,78.11 92.71,78.74 98.42,78.74 99.06,78.11 99.06,74.93 99.69,74.3 99.69,73.03
N$20
  Bottom 1.016: LED17.A R17.1
N$21
  Bottom 1.016: LED18.A R18.1
N$22
  Bottom 1.016: LED19.A R19.1
N$23
  Bottom 1.016: LED20.A R20.1
N$24
  Bottom 1.016: LED21.A R21.1
N$25
  Bottom 1.016: LED22.A R22.1
N$26
  Bottom 1.016: LED23.A R23.1
N$27
  Bottom 1.016: LED24.A R24.1
N$28
  Bottom 1.016: LED32.K 24.13,102.87 25.4,101.6 35.56,101.6 | 46.99,101.6 35.56,101.6 | 58.42,101.6 46.99,101.6 | 69.85,101.6 58.42,101.6 | 81.28,101.6 69.85,101.6 | 92.71,101.6 81.28,101.6 | 92.71,101.6 104.14,101.6 105.41,102.87 105.41,105.41 LED25.K Q4.C | LED31.K 35.56,101.6 | LED30.K 46.99,101.6 | LED29.K 58.42,101.6 | LED28.K 69.85,101.6 | LED27.K 81.28,101.6 | LED26.K 92.71,101.6
  pour Bottom (no thermals): 23.5,104.78 23.5,97.16 24.76,95.89 72.39,95.89 108.59,95.89 109.22,96.52 109.22,98.42 109.22,104.14 109.85,104.78 113.03,104.78 113.66,105.41 113.66,111.12 112.4,112.39 110.49,112.39 105.41,112.39 104.77,112.39 103.5,111.12 103.5,103.5 102.23,102.23 82.55,102.23 29.85,102.23 28.57,103.5 28.57,105.41 27.31,106.68 26.67,106.68 24.76,106.68 23.5,105.41
  pour Bottom (no thermals): 34.29,102.23 34.92,102.87 34.92,106.05 35.56,106.68 41.28,106.68 41.91,106.05 41.91,102.87 42.55,102.23 45.72,102.23 46.35,102.87 46.35,106.05 46.99,106.68 52.7,106.68 53.34,106.05 53.34,102.87 53.97,102.23 57.15,102.23 57.78,102.87 57.78,106.05 58.42,106.68 64.13,106.68 64.77,106.05 64.77,102.87 65.41,102.23 68.58,102.23 69.22,102.87 69.22,106.05 69.85,106.68 75.56,106.68 76.2,106.05 76.2,102.87 76.83,102.23 80.01,102.23 80.64,102.87 80.64,106.05 81.28,106.68 86.99,106.68 87.63,106.05 87.63,102.87 88.27,102.23 91.44,102.23 92.08,102.87 92.08,106.05 92.71,106.68 98.42,106.68 99.06,106.05 99.06,102.87 99.69,102.23 99.69,99.69 34.29,99.69
N$29
  Bottom 1.016: LED25.A R25.1
N$30
  Bottom 1.016: LED26.A R26.1
N$31
  Bottom 1.016: LED27.A R27.1
N$32
  Bottom 1.016: LED28.A R28.1
N$33
  Bottom 1.016: LED29.A R29.1
N$34
  Bottom 1.016: LED30.A R30.1
N$35
  Bottom 1.016: LED31.A R31.1
N$36
  Bottom 1.016: R32.1 LED32.A
N$37
  Bottom 1.016: LED40.K 139.7,21.59 140.97,20.32 151.13,20.32 | 162.56,20.32 151.13,20.32 | 173.99,20.32 162.56,20.32 | 185.42,20.32 173.99,20.32 | 196.85,20.32 185.42,20.32 | 208.28,20.32 196.85,20.32 | 208.28,20.32 219.71,20.32 220.98,21.59 220.98,24.13 LED33.K Q5.C | LED39.K 151.13,20.32 | LED38.K 162.56,20.32 | LED37.K 173.99,20.32 | LED36.K 185.42,20.32 | LED35.K 196.85,20.32 | LED34.K 208.28,20.32
  pour Bottom (no thermals): 146.69,21.59 149.86,21.59 150.5,22.23 150.5,24.77 151.13,25.4 156.84,25.4 157.48,24.77 157.48,22.23 158.12,21.59 161.29,21.59 161.92,22.23 161.92,24.77 162.56,25.4 168.28,25.4 168.91,24.77 168.91,22.23 169.54,21.59 172.72,21.59 173.35,22.23 173.35,24.77 173.99,25.4 179.7,25.4 180.34,24.77 180.34,22.23 180.97,21.59 184.15,21.59 184.78,22.23 184.78,24.77 185.42,25.4 191.13,25.4 191.77,24.77 191.77,22.23 192.41,21.59 195.58,21.59 196.22,22.23 196.22,24.77 196.85,25.4 202.56,25.4 203.2,24.77 203.2,22.23 203.84,21.59 207.01,21.59 207.65,22.23 207.65,24.77 208.28,25.4 214,25.4 214.63,24.77 214.63,22.23 215.26,21.59 218.44,21.59 219.07,22.23 219.07,24.77 219.71,25.4 219.71,27.94 220.98,29.21 227.97,29.21 228.6,28.57 228.6,24.13 227.97,23.5 223.52,23.5 222.88,22.86 222.88,19.68 221.62,18.41 134.62,18.41 133.98,19.05 133.98,20.95 134.62,21.59 138.43,21.59 139.06,22.23 139.06,24.77 139.7,25.4 145.41,25.4 146.05,24.77 146.05,22.23
N$38
  Bottom 1.016: LED33.A R33.1
N$39
  Bottom 1.016: LED34.A R34.1
N$40
  Bottom 1.016: LED35.A R35.1
N$41
  Bottom 1.016: LED36.A R36.1
N$42
  Bottom 1.016: LED37.A R37.1
N$43
  Bottom 1.016: LED38.A R38.1
N$44
  Bottom 1.016: LED39.A R39.1
N$45
  Bottom 1.016: LED40.A R40.1
N$46
  Bottom 1.016: LED48.K 139.7,49.53 140.97,48.26 151.13,48.26 | 196.85,48.26 208.28,48.26 | 185.42,48.26 196.85,48.26 | 173.99,48.26 185.42,48.26 | 162.56,48.26 173.99,48.26 | 151.13,48.26 162.56,48.26 | 208.28,48.26 219.71,48.26 220.98,49.53 220.98,52.07 LED41.K Q6.C | LED42.K 208.28,48.26 | LED43.K 196.85,48.26 | LED44.K 185.42,48.26 | LED45.K 173.99,48.26 | LED46.K 162.56,48.26 | LED47.K 151.13,48.26
  pour Bottom (no thermals): 136.53,47.62 139.7,47.62 140.97,46.35 153.67,46.35 154.31,46.99 157.48,46.99 158.12,46.35 222.88,46.35 223.52,46.99 223.52,50.8 224.16,51.44 227.97,51.44 228.6,52.07 228.6,55.88 227.97,56.52 220.34,56.52 219.07,55.24 219.07,50.16 218.44,49.53 215.26,49.53 214.63,50.16 214.63,52.7 214,53.34 208.28,53.34 207.65,52.7 207.65,50.8 207.01,49.53 203.84,49.53 203.2,50.8 203.2,52.7 202.56,53.34 196.85,53.34 196.22,52.7 196.22,50.8 195.58,49.53 192.41,49.53 191.77,50.8 191.77,52.7 191.13,53.34 185.42,53.34 184.78,52.7 184.78,50.8 184.15,49.53 180.97,49.53 180.34,50.8 180.34,52.7 179.7,53.34 173.99,53.34 173.35,52.7 173.35,50.8 172.72,49.53 169.54,49.53 168.91,50.8 168.91,52.7 168.28,53.34 162.56,53.34 161.92,52.7 161.92,50.8 161.29,49.53 158.12,49.53 157.48,50.8 157.48,52.7 156.84,53.34 151.13,53.34 150.5,52.7 150.5,50.8 149.86,49.53 146.69,49.53 146.05,50.8 146.05,52.7 145.41,53.34 139.7,53.34 139.06,52.7 139.06,50.16 138.43,49.53 135.89,49.53 135.89,48.26
N$47
  Bottom 1.016: LED41.A R41.1
N$48
  Bottom 1.016: LED42.A R42.1
N$49
  Bottom 1.016: LED43.A R43.1
N$50
  Bottom 1.016: LED44.A R44.1
N$51
  Bottom 1.016: LED45.A R45.1
N$52
  Bottom 1.016: LED46.A R46.1
N$53
  Bottom 1.016: R47.1 LED47.A
N$54
  Bottom 1.016: R48.1 LED48.A
N$55
  Bottom 1.016: LED56.K 139.7,74.93 140.97,73.66 151.13,73.66 | 196.85,73.66 208.28,73.66 | 185.42,73.66 196.85,73.66 | 173.99,73.66 185.42,73.66 | 162.56,73.66 173.99,73.66 | 151.13,73.66 162.56,73.66 | 208.28,73.66 219.71,73.66 220.98,74.93 220.98,77.47 LED49.K Q7.C | LED50.K 208.28,73.66 | LED51.K 196.85,73.66 | LED52.K 185.42,73.66 | LED53.K 173.99,73.66 | LED54.K 162.56,73.66 | LED55.K 151.13,73.66
  pour Bottom (no thermals): 139.06,77.47 139.06,78.11 139.7,78.74 144.78,78.74 145.41,78.74 146.05,78.11 146.05,75.56 146.69,74.93 149.86,74.93 150.5,75.56 150.5,78.11 151.13,78.74 156.84,78.74 157.48,78.11 157.48,75.56 158.12,74.93 161.29,74.93 161.92,75.56 161.92,78.11 162.56,78.74 168.28,78.74 168.91,78.11 168.91,75.56 169.54,74.93 172.72,74.93 173.35,75.56 173.35,78.11 173.99,78.74 179.7,78.74 180.34,78.11 180.34,75.56 180.97,74.93 184.15,74.93 184.78,75.56 184.78,78.11 185.42,78.74 191.13,78.74 191.77,78.11 191.77,75.56 192.41,74.93 195.58,74.93 196.22,75.56 196.22,78.11 196.85,78.74 202.56,78.74 203.2,78.11 203.2,75.56 203.84,74.93 207.01,74.93 207.65,75.56 207.65,78.11 208.28,78.74 214,78.74 214.63,78.11 214.63,75.56 215.26,74.93 218.44,74.93 219.07,75.56 219.07,78.11 219.07,79.38 219.71,80.01 227.97,80.01 228.6,79.38 228.6,77.47 227.97,76.83 224.79,76.83 224.16,76.2 224.16,73.03 223.52,72.39 222.88,71.75 208.91,71.75 195.58,71.75 178.44,71.75 177.8,72.39 137.16,72.39 135.89,73.66 135.89,74.93 136.53,75.56 138.43,75.56 139.06,76.2
N$56
  Bottom 1.016: R49.1 LED49.A
N$57
  Bottom 1.016: R50.1 LED50.A
N$58
  Bottom 1.016: R51.1 LED51.A
N$59
  Bottom 1.016: R52.1 LED52.A
N$60
  Bottom 1.016: R53.1 LED53.A
N$61
  Bottom 1.016: R54.1 LED54.A
N$62
  Bottom 1.016: R55.1 LED55.A
N$63
  Bottom 1.016: R56.1 LED56.A
N$64
  Bottom 1.016: LED64.K 139.7,102.87 140.97,101.6 151.13,101.6 | 208.28,101.6 219.71,101.6 220.98,102.87 220.98,105.41 LED57.K Q8.C | 196.85,101.6 208.28,101.6 | 185.42,101.6 196.85,101.6 | 173.99,101.6 185.42,101.6 | 162.56,101.6 173.99,101.6 | 151.13,101.6 162.56,101.6 | LED58.K 208.28,101.6 | LED59.K 196.85,101.6 | LED60.K 185.42,101.6 | LED61.K 173.99,101.6 | LED62.K 162.56,101.6 | LED63.K 151.13,101.6
  pour Bottom (no thermals): 139.06,106.05 139.7,106.68 145.41,106.68 146.05,106.05 146.05,104.14 146.69,102.87 149.86,102.87 150.5,104.14 150.5,106.05 151.13,106.68 156.84,106.68 157.48,106.05 157.48,104.14 158.12,102.87 161.29,102.87 161.92,104.14 161.92,106.05 162.56,106.68 168.28,106.68 168.91,106.05 168.91,104.14 169.54,102.87 172.72,102.87 173.35,104.14 173.35,106.05 173.99,106.68 179.7,106.68 180.34,106.05 180.34,104.14 180.97,102.87 184.15,102.87 184.78,104.14 184.78,106.05 185.42,106.68 191.13,106.68 191.77,106.05 191.77,104.14 192.41,102.87 195.58,102.87 196.22,104.14 196.22,106.05 196.85,106.68 202.56,106.68 203.2,106.05 203.2,104.14 203.84,102.87 207.01,102.87 207.65,104.14 207.65,106.05 208.28,106.68 214,106.68 214.63,106.05 214.63,104.14 215.26,102.87 218.44,102.87 219.07,104.14 219.07,106.68 220.34,107.95 227.97,107.95 228.6,107.31 228.6,105.41 227.97,104.78 224.79,104.78 224.16,104.14 224.16,100.33 223.52,99.69 142.88,99.69 142.24,100.33 135.89,100.33 135.25,100.97 135.25,102.87 135.89,103.5 138.43,103.5 139.06,104.14
N$65
  Bottom 1.016: R57.1 LED57.A
N$66
  Bottom 1.016: R58.1 LED58.A
N$67
  Bottom 1.016: R59.1 LED59.A
N$68
  Bottom 1.016: R60.1 LED60.A
N$69
  Bottom 1.016: LED61.A R61.1
N$70
  Bottom 1.016: LED62.A R62.1
N$71
  Bottom 1.016: LED63.A R63.1
N$72
  Bottom 1.016: LED64.A R64.1
N$73
  Bottom 1.016: Q9.B R65.2
N$74
  Bottom 1.016: R65.1 T1.C R81.1
  pour Bottom (no thermals): 94.61,140.34 93.98,139.7 93.98,134.62 94.61,133.99 102.23,133.99 102.87,134.62 102.87,139.7 102.23,140.34 96.52,140.34
N$75
  Bottom 1.016: R66.1 T2.C R82.1
  pour Bottom (no thermals): 90.17,133.99 91.44,133.99 92.08,134.62 92.08,139.7 91.44,140.34 83.19,140.34 82.55,139.7 82.55,134.62 83.19,133.99 88.9,133.99
N$76
  Bottom 1.016: R66.2 Q10.B
N$77
  Bottom 1.016: R83.1 T3.C R67.1
  pour Bottom (no thermals): 78.74,133.99 80.01,133.99 80.64,134.62 80.64,139.7 80.01,140.34 71.75,140.34 71.12,139.7 71.12,134.62 71.75,133.99 77.47,133.99
N$78
  Bottom 1.016: Q11.B R67.2
N$79
  Bottom 1.016: R84.1 T4.C R68.1
  pour Bottom (no thermals): 60.96,140.34 60.33,140.34 59.69,139.7 59.69,134.62 60.33,133.99 68.58,133.99 69.22,134.62 69.22,139.7 68.58,140.34 64.77,140.34
N$80
  Bottom 1.016: Q12.B R68.2
N$81
  Bottom 1.016: R69.1 T5.C R85.1
  pour Bottom (no thermals): 49.53,140.34 48.89,140.34 48.26,139.7 48.26,134.62 48.89,133.99 57.15,133.99 57.78,134.62 57.78,139.7 57.15,140.34
N$82
  Bottom 1.016: Q13.B R69.2
N$83
  Bottom 1.016: R70.1 T6.C R86.1
  pour Bottom (no thermals): 38.73,133.99 45.72,133.99 46.35,134.62 46.35,139.7 45.72,140.34 37.47,140.34 36.83,139.7 36.83,134.62 37.47,133.99 38.1,133.99
N$84
  Bottom 1.016: R70.2 Q14.B
N$85
  Bottom 1.016: R71.1 T7.C R87.1
  pour Bottom (no thermals): 21.59,140.34 20.32,140.34 19.68,139.7 19.68,134.62 20.32,133.99 28.57,133.99 29.21,134.62 29.21,139.7 28.57,140.34 27.94,140.34
N$86
  Bottom 1.016: Q15.B R71.2
N$87
  Bottom 1.016: R72.1 T8.C R88.1
  pour Bottom (no thermals): 8.89,134.62 9.52,133.99 17.14,133.99 17.78,134.62 17.78,139.7 17.14,140.34 9.52,140.34 8.89,139.7
N$88
  Bottom 1.016: Q16.B R72.2
N$89
  Bottom 1.016: Q8.B R80.2
N$90
  Bottom 1.016: Q7.B R79.2
N$91
  Bottom 1.016: Q6.B R78.2
N$92
  Bottom 1.016: Q5.B R77.2
N$93
  Bottom 1.016: Q4.B R76.2
N$94
  Bottom 1.016: Q3.B R75.2
N$95
  Bottom 1.016: Q2.B R74.2
N$96
  Bottom 1.016: Q1.B R73.2
N$97
  Bottom 1.016: R96.1 T8.B
N$99
  Bottom 1.016: R95.1 T7.B
N$101
  Bottom 1.016: R94.1 T6.B
N$103
  Bottom 1.016: R93.1 T5.B
N$105
  Bottom 1.016: T4.B R92.1
N$107
  Bottom 1.016: T3.B R91.1
N$109
  Bottom 1.016: T1.B R89.1
N$110
  Bottom 1.016: T2.B R90.1
P1  (via drill 0.8 pad 2.5)
  Top 1.016: v97.16,38.1 v97.16,67.31 v97.16,92.71 97.16,97.79 | 97.16,97.79 v97.16,120.65 | v212.72,38.1 v212.72,67.31 v212.72,92.71 v212.72,120.65 | 97.16,97.79 v139.7,97.79
  Bottom 1.016: Q9.C R25.2 v97.16,120.65 | R1.2 v97.16,38.1 | R17.2 v97.16,92.71 | R9.2 v97.16,67.31 | R33.2 v212.72,38.1 | v212.72,120.65 R57.2 | R49.2 v212.72,92.71 207.65,97.79 v139.7,97.79 | R41.2 v212.72,67.31
  pour Top (no thermals): 102.23,36.2 102.87,36.2 103.5,36.83 103.5,43.18 102.87,43.81 102.23,44.45 99.69,44.45 99.06,45.09 99.06,62.87 99.69,63.5 102.87,63.5 103.5,64.14 103.5,70.48 102.87,71.12 99.69,71.12 99.06,71.75 99.06,88.27 99.69,88.9 102.87,88.9 103.5,89.53 103.5,92.71 103.5,93.98 103.5,94.61 104.77,95.89 105.41,96.52 140.34,96.52 140.97,96.52 141.6,97.16 141.6,98.42 140.97,99.06 132.72,99.06 132.08,98.42 105.41,98.42 103.5,100.33 99.69,100.33 99.06,100.97 99.06,106.68 99.06,116.2 99.69,116.84 102.87,116.84 103.5,117.47 103.5,124.46 102.87,125.09 94.61,125.09 93.98,124.46 93.98,117.47 93.98,107.95 93.98,95.25 93.98,81.92 93.98,69.85 93.98,52.7 93.98,44.45 93.98,36.83 94.61,36.2 101.6,36.2
  pour Top (no thermals): 209.55,121.92 209.55,36.83 210.19,36.2 218.44,36.2 219.07,36.83 219.07,43.18 218.44,43.81 215.26,43.81 214.63,44.45 214.63,62.87 215.26,63.5 218.44,63.5 219.07,64.14 219.07,71.12 218.44,71.75 215.26,71.75 214.63,72.39 214.63,88.27 215.26,88.9 218.44,88.9 219.07,89.53 219.07,99.06 218.44,99.69 215.26,99.69 214.63,100.33 214.63,118.11 215.26,118.75 218.44,118.75 219.07,119.38 219.07,121.92 218.44,122.56 210.19,122.56
P2  (via drill 0.8 pad 2.5)
  Top 1.016: v85.72,38.1 v85.72,67.31 v85.72,92.71 v85.72,120.65 | v201.29,38.1 v201.29,67.31 v201.29,88.9 v201.29,92.71 v201.29,120.65 | v116.2,88.9 v140.34,88.9
  Bottom 1.016: Q10.C R26.2 v85.72,120.65 | R2.2 v85.72,38.1 | v85.72,92.71 R18.2 93.34,89.53 93.34,88.9 v116.2,88.9 | R10.2 v85.72,67.31 | R34.2 v201.29,38.1 | v201.29,120.65 R58.2 | R50.2 v201.29,92.71 | R42.2 v201.29,67.31 | v140.34,88.9 v201.29,88.9
  pour Top (no thermals): 90.8,36.2 91.44,36.2 92.08,36.83 92.08,43.18 91.44,43.81 88.27,43.81 87.63,44.45 87.63,56.52 87.63,62.87 88.27,63.5 91.44,63.5 92.08,64.14 92.08,70.48 91.44,71.12 88.27,71.12 87.63,71.75 87.63,76.83 87.63,88.27 88.27,88.9 91.44,88.9 92.08,89.53 92.08,95.25 91.44,95.89 88.27,95.89 87.63,96.52 87.63,116.2 88.27,116.84 91.44,116.84 92.08,117.47 92.08,124.46 91.44,125.09 83.19,125.09 82.55,124.46 82.55,117.47 82.55,106.05 82.55,88.27 82.55,68.58 82.55,50.8 82.55,36.83 83.19,36.2 89.53,36.2
  pour Top (no thermals): 198.12,120.65 198.12,121.92 198.75,122.56 207.01,122.56 207.65,121.92 207.65,119.38 207.01,118.75 203.84,118.75 203.2,118.11 203.2,111.76 203.2,102.23 203.2,100.33 203.84,99.69 207.01,99.69 207.65,99.06 207.65,91.44 207.65,89.53 207.01,88.9 203.84,88.9 203.2,88.27 203.2,80.01 203.2,72.39 203.84,71.75 207.01,71.75 207.65,71.12 207.65,64.14 207.01,63.5 203.84,63.5 203.2,62.87 203.2,57.15 203.2,44.45 203.84,43.81 207.01,43.81 207.65,43.18 207.65,36.83 207.01,36.2 198.75,36.2 198.12,36.83 198.12,44.45 198.12,59.05 198.12,79.38 198.12,99.06 198.12,113.67 198.12,119.38
P3  (via drill 0.8 pad 2.5)
  Top 1.016: v73.66,38.1 v73.66,67.31 v73.66,92.71 v73.66,120.65 | v189.87,38.1 v189.87,67.31 v189.87,92.71 v189.87,120.65 | v116.2,116.84 v140.34,116.84
  Bottom 1.016: 78.74,121.28 Q11.C | 78.74,121.28 R27.2 | R3.2 v73.66,38.1 | 78.74,121.28 78.1,120.65 v73.66,120.65 77.47,116.84 v116.2,116.84 | R19.2 v73.66,92.71 | R11.2 v73.66,67.31 | R35.2 v189.87,38.1 | R59.2 v189.87,120.65 189.87,118.11 188.59,116.84 v140.34,116.84 | R51.2 v189.87,92.71 | R43.2 v189.87,67.31
  pour Top (no thermals): 71.12,43.81 71.12,36.83 71.75,36.2 80.01,36.2 80.64,36.83 80.64,43.18 80.01,43.81 76.83,43.81 76.2,44.45 76.2,62.87 76.83,63.5 80.01,63.5 80.64,64.14 80.64,70.48 80.01,71.12 76.83,71.12 76.2,71.75 76.2,88.27 76.83,88.9 80.01,88.9 80.64,89.53 80.64,95.25 80.01,95.89 76.83,95.89 76.2,96.52 76.2,116.2 76.83,116.84 80.01,116.84 80.64,117.47 80.64,124.46 80.01,125.09 71.75,125.09 71.12,124.46 71.12,85.09 71.12,76.2 71.12,66.67 71.12,55.24 71.12,45.09
  pour Top (no thermals): 186.69,121.92 187.32,122.56 194.31,122.56 195.58,122.56 196.22,121.92 196.22,119.38 195.58,118.75 192.41,118.75 191.77,118.11 191.77,100.33 192.41,99.69 195.58,99.69 196.22,99.06 196.22,89.53 195.58,88.9 192.41,88.9 191.77,88.27 191.77,72.39 192.41,71.75 195.58,71.75 196.22,71.12 196.22,64.14 195.58,63.5 192.41,63.5 191.77,62.87 191.77,44.45 192.41,43.81 195.58,43.81 196.22,43.18 196.22,36.83 195.58,36.2 187.32,36.2 186.69,36.83 186.69,46.35 186.69,65.41 186.69,71.12 186.69,84.45 186.69,93.34 186.69,102.87 186.69,120.65
P4  (via drill 0.8 pad 2.5)
  Top 1.016: v62.86,38.1 v62.86,67.31 v62.86,92.71 v62.86,120.65 | v178.44,38.1 v178.44,67.31 v178.44,92.71 v178.44,120.65 | v116.84,69.22 128.91,69.22 130.17,70.48 v140.34,70.48
  Bottom 1.016: Q12.C R28.2 v62.86,120.65 | R4.2 v62.86,38.1 | R20.2 v62.86,92.71 | R12.2 v62.86,67.31 64.13,67.31 67.31,70.48 104.14,70.48 105.41,69.22 v116.84,69.22 | R36.2 v178.44,38.1 | v178.44,120.65 R60.2 | R52.2 v178.44,92.71 | R44.2 v178.44,67.31 175.26,70.48 v140.34,70.48
  pour Top (no thermals): 59.05,40.64 59.05,36.83 59.69,36.2 68.58,36.2 69.22,36.83 69.22,43.18 68.58,43.81 65.41,43.81 64.77,44.45 64.77,62.87 65.41,63.5 68.58,63.5 69.22,64.14 69.22,70.48 68.58,71.12 65.41,71.12 64.77,71.75 64.77,88.27 65.41,88.9 68.58,88.9 69.22,89.53 69.22,95.25 68.58,95.89 65.41,95.89 64.77,96.52 64.77,116.2 65.41,116.84 68.58,116.84 69.22,117.47 69.22,124.46 68.58,125.09 60.33,125.09 59.69,124.46 59.69,41.27
  pour Top (no thermals): 174.62,121.28 174.62,121.92 175.26,122.56 184.15,122.56 184.78,121.92 184.78,119.38 184.15,118.75 180.97,118.75 180.34,118.11 180.34,100.33 180.97,99.69 184.15,99.69 184.78,99.06 184.78,89.53 184.15,88.9 180.97,88.9 180.34,88.27 180.34,76.2 180.34,73.03 180.97,72.39 184.15,72.39 184.78,71.75 184.78,64.14 184.15,63.5 180.97,63.5 180.34,62.87 180.34,50.16 180.34,44.45 180.97,43.81 184.15,43.81 184.78,43.18 184.78,36.83 184.15,36.2 175.9,36.2 175.26,36.83 175.26,48.26 175.26,68.58 175.26,86.36 175.26,118.11 174.62,118.75
P5  (via drill 0.8 pad 2.5)
  Top 1.016: v51.44,38.1 v51.44,67.31 v51.44,92.71 v51.44,120.65 | v167,38.1 v167,63.5 v167,67.31 v167,92.71 v167,120.65 | v116.84,63.5 v140.34,63.5
  Bottom 1.016: Q13.C R29.2 v51.44,120.65 | R5.2 v51.44,38.1 | R21.2 v51.44,92.71 | R13.2 v51.44,67.31 55.24,63.5 v116.84,63.5 | R37.2 v167,38.1 | v167,120.65 R61.2 | R53.2 v167,92.71 | R45.2 v167,67.31 | v140.34,63.5 v167,63.5
  pour Top (no thermals): 48.26,38.73 48.26,36.83 48.89,36.2 56.52,36.2 57.15,36.83 57.15,43.18 56.52,43.81 53.97,43.81 53.34,44.45 53.34,62.87 53.97,63.5 57.15,63.5 57.78,64.14 57.78,70.48 57.15,71.12 53.97,71.12 53.34,71.75 53.34,88.27 53.97,88.9 57.15,88.9 57.78,89.53 57.78,95.25 57.15,95.89 53.97,95.89 53.34,96.52 53.34,116.2 53.97,116.84 57.15,116.84 57.78,117.47 57.78,124.46 57.15,125.09 48.89,125.09 48.26,124.46 48.26,117.47 48.26,95.25 48.26,40.01
  pour Top (no thermals): 163.19,118.75 163.19,121.92 163.83,122.56 164.47,122.56 172.09,122.56 172.72,121.92 172.72,119.38 172.09,118.75 169.54,118.75 168.91,118.11 168.91,104.78 168.91,100.33 169.54,99.69 172.72,99.69 173.35,99.06 173.35,89.53 172.72,88.9 169.54,88.9 168.91,88.27 168.91,73.03 169.54,72.39 172.72,72.39 173.35,71.75 173.35,64.14 172.72,63.5 169.54,63.5 168.91,62.87 168.91,50.8 168.91,44.45 169.54,43.81 172.72,43.81 173.35,43.18 173.35,36.83 172.72,36.2 164.47,36.2 163.83,36.83 163.83,41.91 163.83,58.42 163.83,68.58 163.83,79.38 163.83,89.53 163.83,102.23 163.83,116.2 163.19,116.84
P6  (via drill 0.8 pad 2.5)
  Top 1.016: v39.37,38.1 39.37,44.45 | 39.37,44.45 v39.37,67.31 v39.37,92.71 v39.37,120.65 | v155.57,38.1 v155.57,44.45 v155.57,67.31 v155.57,92.71 v155.57,120.65 | 39.37,44.45 v44.45,44.45 | v106.05,44.45 v138.43,44.45
  Bottom 1.016: Q14.C R30.2 v39.37,120.65 | R6.2 v39.37,38.1 | v39.37,67.31 R14.2 | v39.37,92.71 R22.2 | R38.2 v155.57,38.1 | v155.57,120.65 R62.2 | R54.2 v155.57,92.71 | R46.2 v155.57,67.31 | v44.45,44.45 v106.05,44.45 | v138.43,44.45 v155.57,44.45
  pour Top (no thermals): 36.19,38.73 36.19,36.83 36.83,36.2 45.08,36.2 45.72,36.2 46.35,36.83 46.35,45.09 46.35,45.72 45.72,46.35 41.91,46.35 41.28,46.99 41.28,58.42 41.28,62.87 41.91,63.5 45.72,63.5 46.35,64.14 46.35,70.48 45.72,71.12 41.91,71.12 41.28,71.75 41.28,82.55 41.28,88.27 41.91,88.9 45.72,88.9 46.35,89.53 46.35,95.25 45.72,95.89 41.91,95.89 41.28,96.52 41.28,116.2 41.91,116.84 45.72,116.84 46.35,117.47 46.35,124.46 45.72,125.09 40.64,125.09 37.47,125.09 36.19,123.83 36.19,107.31 36.19,39.37
  pour Top (no thermals): 153.03,36.83 153.67,36.2 161.29,36.2 161.92,36.83 161.92,43.81 161.29,44.45 158.12,44.45 157.48,45.09 157.48,55.88 157.48,62.87 158.12,63.5 161.29,63.5 161.92,64.14 161.92,71.75 161.29,72.39 158.12,72.39 157.48,73.03 157.48,81.92 157.48,88.27 158.12,88.9 161.29,88.9 161.92,89.53 161.92,99.06 161.29,99.69 158.12,99.69 157.48,100.33 157.48,106.68 157.48,118.11 158.12,118.75 160.66,118.75 161.29,119.38 161.29,121.92 160.66,122.56 154.31,122.56 153.67,121.92 153.67,111.76 152.4,110.49 152.4,98.42 152.4,37.47
P7  (via drill 0.8 pad 2.5)
  Top 1.016: v28.57,38.1 v28.57,67.31 v28.57,92.71 v28.57,120.65 | 144.15,41.27 v144.15,38.1 | 144.15,41.27 v144.15,67.31 v144.15,92.71 v144.15,120.65 | v114.94,41.27 123.82,41.27 127,41.27 144.15,41.27
  Bottom 1.016: Q15.C R31.2 v28.57,120.65 | v28.57,38.1 R7.2 33.02,40.01 34.29,41.27 v114.94,41.27 | v28.57,67.31 R15.2 | v28.57,92.71 R23.2 | R39.2 v144.15,38.1 | v144.15,120.65 R63.2 | R55.2 v144.15,92.71 | R47.2 v144.15,67.31
  pour Top (no thermals): 26.04,109.86 26.04,124.46 26.67,125.09 33.66,125.09 34.29,124.46 34.29,116.84 33.66,116.2 31.75,116.2 30.48,114.94 30.48,95.89 31.11,95.25 33.66,95.25 34.29,94.61 34.29,89.53 33.66,88.9 31.11,88.9 30.48,88.27 30.48,69.22 31.11,68.58 33.66,68.58 34.29,67.94 34.29,64.14 33.66,63.5 31.11,63.5 30.48,62.87 30.48,44.45 31.11,43.81 33.66,43.81 34.29,43.18 34.29,36.83 33.66,36.2 27.31,36.2 26.67,36.83 26.67,109.22
  pour Top (no thermals): 142.24,54.61 142.24,36.83 142.88,36.2 149.86,36.2 150.5,36.83 150.5,43.81 149.86,44.45 146.69,44.45 146.05,45.09 146.05,62.87 146.69,63.5 149.86,63.5 150.5,64.14 150.5,71.75 149.86,72.39 146.69,72.39 146.05,73.03 146.05,88.27 146.69,88.9 149.86,88.9 150.5,89.53 150.5,99.06 149.86,99.69 146.69,99.69 146.05,100.33 146.05,118.11 146.69,118.75 149.22,118.75 149.86,119.38 149.86,121.92 149.22,122.56 143.51,122.56 142.88,121.28 142.88,55.24
P8  (via drill 0.8 pad 2.5)
  Top 1.016: v114.94,34.29 v133.35,34.29
  Bottom 1.016: Q16.C R32.2 19.05,120.65 17.14,118.75 17.14,94.61 19.05,92.71 | 19.05,92.71 R24.2 | 19.05,92.71 17.14,90.81 17.14,68.58 18.42,67.31 | R16.2 20.32,67.31 18.42,67.31 | 18.42,67.31 17.14,66.04 17.14,39.37 18.42,38.1 R8.2 22.86,36.83 22.86,34.92 23.5,34.29 v114.94,34.29 | R64.2 135.25,120.65 133.98,119.38 133.98,93.98 135.25,92.71 | 135.25,92.71 R56.2 | 135.25,92.71 133.98,91.44 133.98,68.58 135.25,67.31 | R48.2 135.89,67.31 135.25,67.31 | 135.25,67.31 133.98,66.04 133.98,39.37 135.25,38.1 R40.2 137.16,35.56 | v133.35,34.29 135.89,34.29 137.16,35.56 | 137.16,35.56 137.16,36.2

### Text on the board
Top: 2017-II | P8 | P7 | P6 | P5 | P4 | P3 | P2 | P1 | N4 | N8 | N7 | N3 | N6 | N2 | N5 | N1 | .:PROYECTO DE INTRODUCCION:.
Bottom: 2017-II | .:UNIVERSIDAD INDUSTRIAL DE SANTANDER:.